# Altium project 新zynq底板.PrjPcb (part 1 of 2)
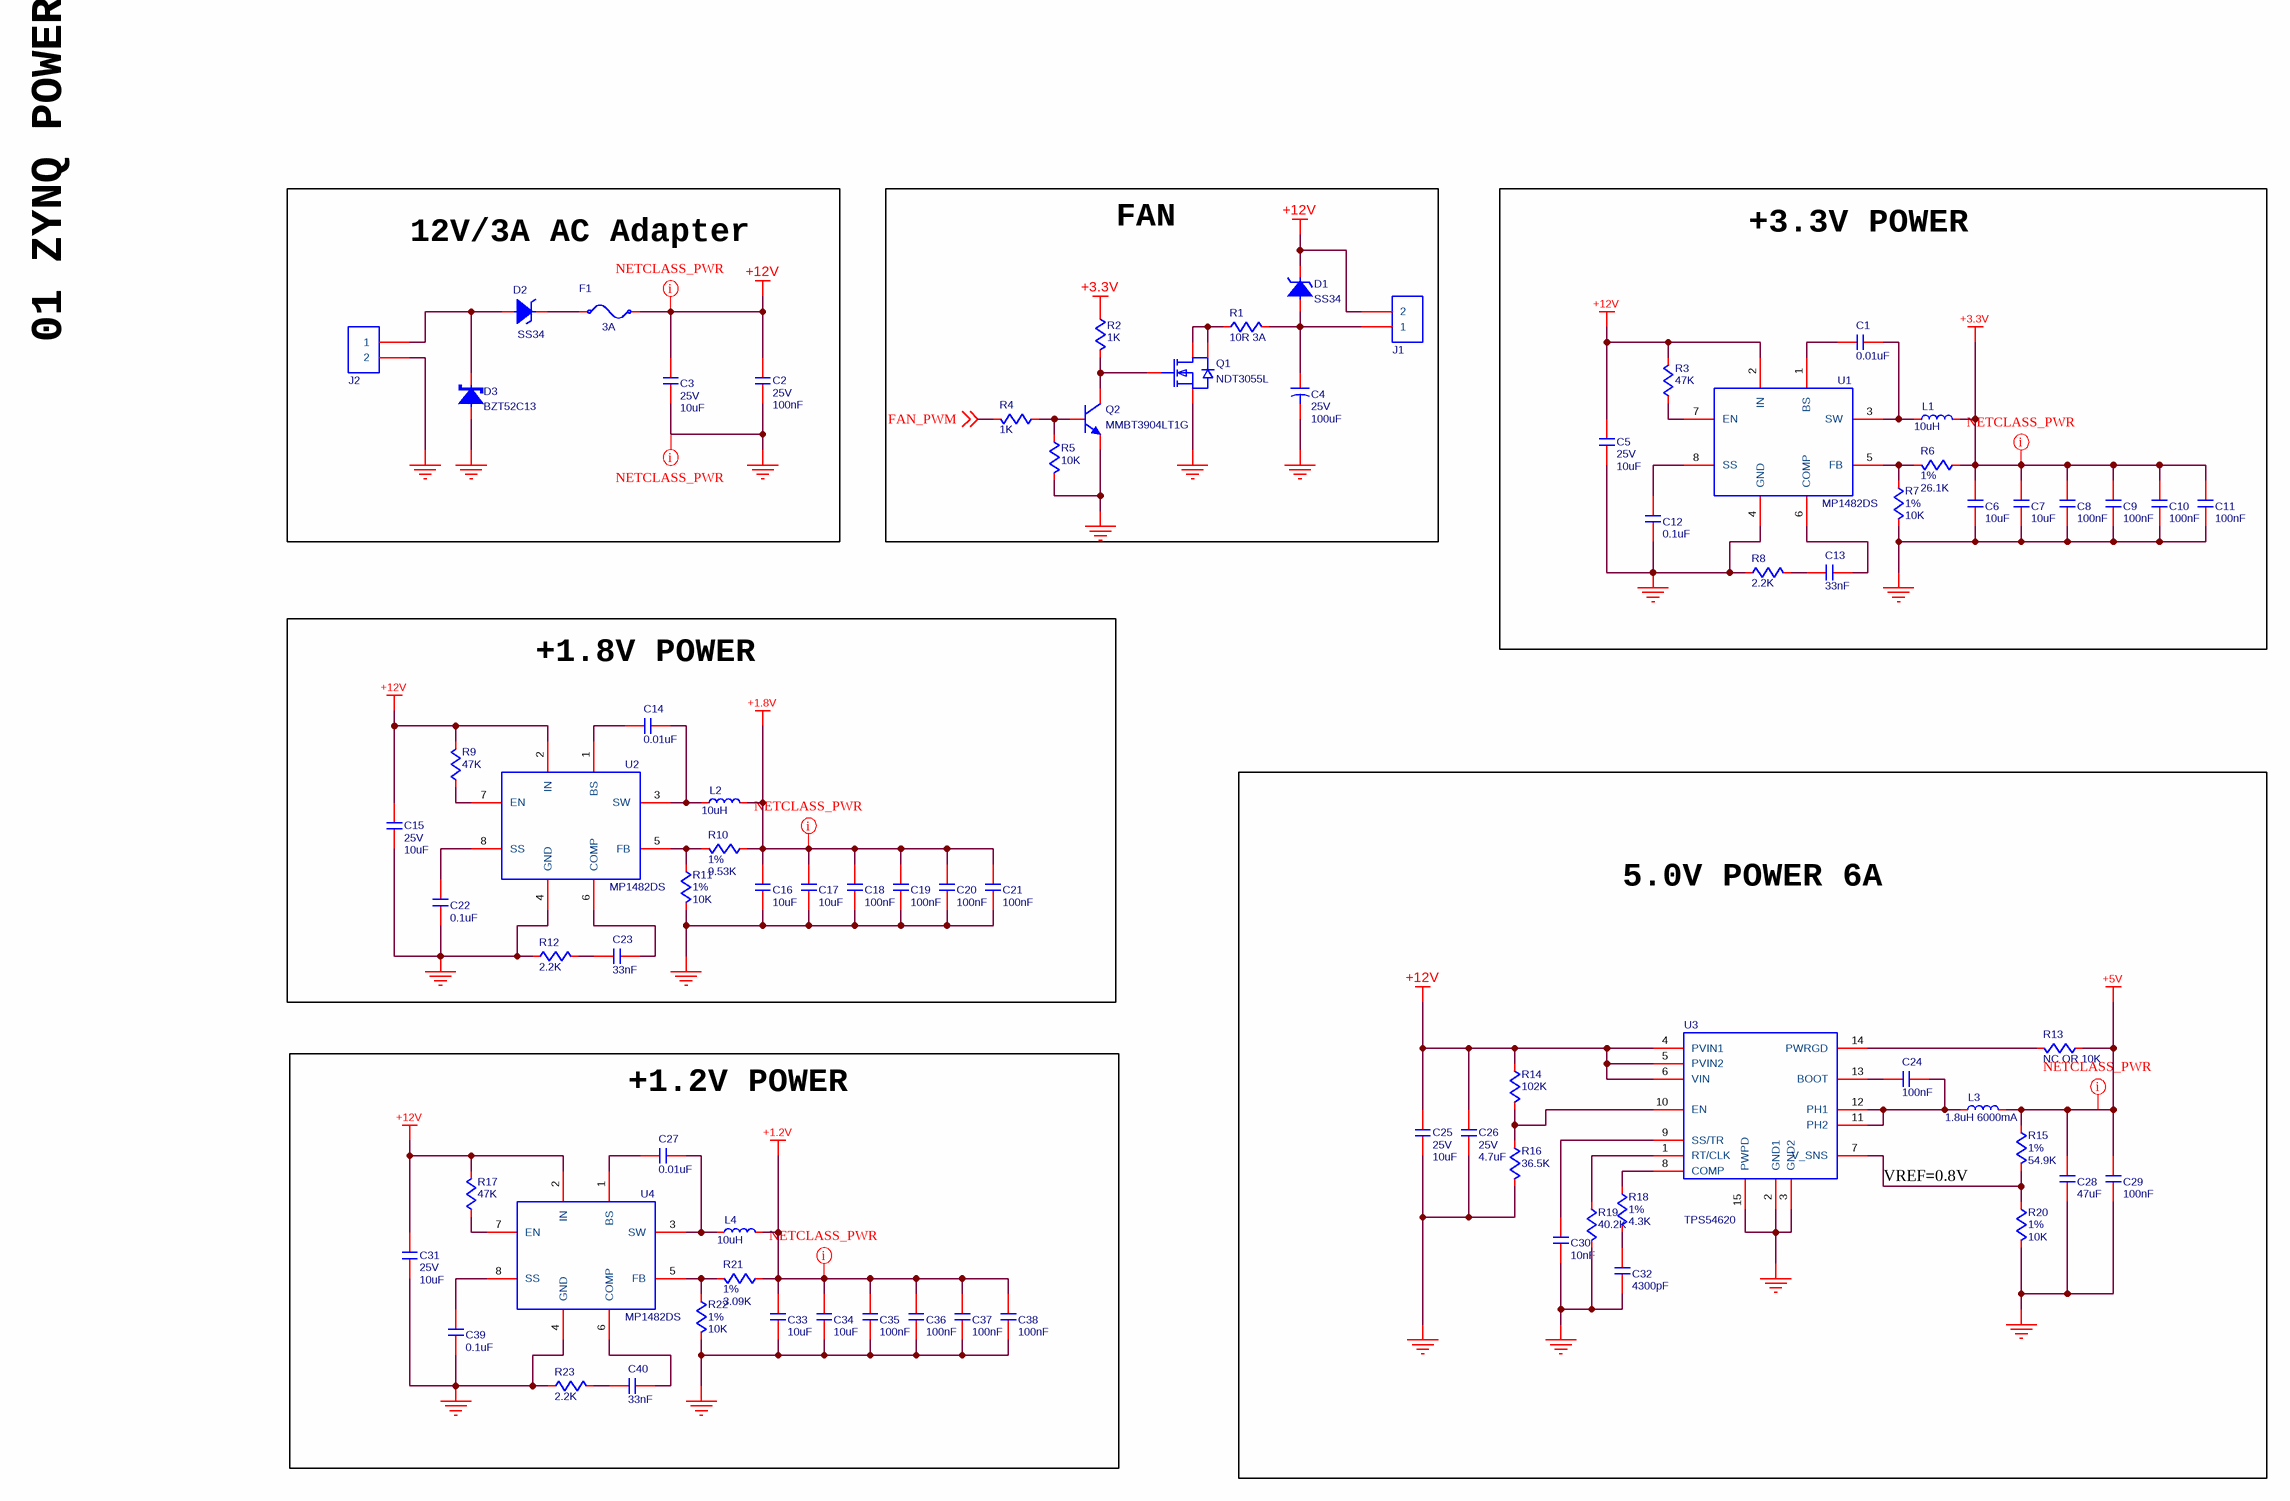
[diagram p0: 01_ZYNQ_POWER.SchDoc]
7 sheets, 397 parts. Net scope: global (net labels, ports and power ports of the same name join across sheets).
Board file: dingkun.PcbDoc
Sheets:
  01_ZYNQ_POWER.SchDoc
  02_ZYNQ_CORE_POS.SchDoc
  03_ZYNQ_JTAG_BOOT.SchDoc
  04_ZYNQ_MISC_INTERFACE.SchDoc
  05_ZYNQ_ETHERNET.SchDoc
  06_ZYNQ_CAMERALINK.SchDoc
  07_ZYNQ_CAMERALINK.SchDoc

## Sheet 01_ZYNQ_POWER.SchDoc
size 420 x 297 mm; SheetNumber: 1; SheetTotal: 7

### Parts
C1  value 0.01uF  [C0402]  (hidden comment: C-NOMO)
C2  value 100nF  voltage: 25V  [C0402]  (hidden comment: C-NOMO)
C3  value 10uF  voltage: 25V  [C0805]  (hidden comment: C-NOMO)
C4  value 100uF  voltage: 25V  [C7343]  (hidden comment: C-POL)
C5  value 10uF  voltage: 25V  [C0805]  (hidden comment: C-NOMO)
C6  value 10uF  [C0805]  (hidden comment: C-NOMO)
C7  value 10uF  [C0805]  (hidden comment: C-NOMO)
C8  value 100nF  [C0402]  (hidden comment: C-NOMO)
C9  value 100nF  [C0402]  (hidden comment: C-NOMO)
C10  value 100nF  [C0402]  (hidden comment: C-NOMO)
C11  value 100nF  [C0402]  (hidden comment: C-NOMO)
C12  value 0.1uF  [C0402]  (hidden comment: C-NOMO)
C13  value 33nF  [C0402]  (hidden comment: C-NOMO)
C14  value 0.01uF  [C0402]  (hidden comment: C-NOMO)
C15  value 10uF  voltage: 25V  [C0805]  (hidden comment: C-NOMO)
C16  value 10uF  [C0805]  (hidden comment: C-NOMO)
C17  value 10uF  [C0805]  (hidden comment: C-NOMO)
C18  value 100nF  [C0402]  (hidden comment: C-NOMO)
C19  value 100nF  [C0402]  (hidden comment: C-NOMO)
C20  value 100nF  [C0402]  (hidden comment: C-NOMO)
C21  value 100nF  [C0402]  (hidden comment: C-NOMO)
C22  value 0.1uF  [C0402]  (hidden comment: C-NOMO)
C23  value 33nF  [C0402]  (hidden comment: C-NOMO)
C24  value 100nF  [C0402]  (hidden comment: C-NOMO)
C25  value 10uF  voltage: 25V  [C0805]  (hidden comment: C-NOMO)
C26  value 4.7uF  voltage: 25V  [C0805]  (hidden comment: C-NOMO)
C27  value 0.01uF  [C0402]  (hidden comment: C-NOMO)
C28  value 47uF  [C0805]  (hidden comment: C-NOMO)
C29  value 100nF  [C0402]  (hidden comment: C-NOMO)
C30  value 10nF  [C0402]  (hidden comment: C-NOMO)
C31  value 10uF  voltage: 25V  [C0805]  (hidden comment: C-NOMO)
C32  value 4300pF  [C0402]  (hidden comment: C-NOMO)
C33  value 10uF  [C0805]  (hidden comment: C-NOMO)
C34  value 10uF  [C0805]  (hidden comment: C-NOMO)
C35  value 100nF  [C0402]  (hidden comment: C-NOMO)
C36  value 100nF  [C0402]  (hidden comment: C-NOMO)
C37  value 100nF  [C0402]  (hidden comment: C-NOMO)
C38  value 100nF  [C0402]  (hidden comment: C-NOMO)
C39  value 0.1uF  [C0402]  (hidden comment: C-NOMO)
C40  value 33nF  [C0402]  (hidden comment: C-NOMO)
D1  SS34  [DO-214AC]
D2  SS34  [DO-214AC]
D3  BZT52C13  [DO-214AC]
F1  3A  [F1812]
J1  HDR1X2  [XH-2A]  (value not drawn)
J2  HDR1X2  [KF301-5.0-2P]  (value not drawn)
L1  value 10uH  [FXL0624]  (hidden comment: L)
L2  value 10uH  [FXL0624]  (hidden comment: L)
L3  value 1.8uH 6000mA  [FXL0624]  (hidden comment: L)
L4  value 10uH  [FXL0624]  (hidden comment: L)
Q1  NDT3055L  [SOT-223]
Q2  MMBT3904LT1G  [SOT-23]
R1  value 10R 3A  [R1812]  (hidden comment: R)
R2  value 1K  [R0402]  (hidden comment: R)
R3  value 47K  [R0402]  (hidden comment: R)
R4  value 1K  [R0402]  (hidden comment: R)
R5  value 10K  [R0402]  (hidden comment: R)
R6  value 26.1K  precision: 1%  [R0402]  (hidden comment: R)
R7  value 10K  precision: 1%  [R0402]  (hidden comment: R)
R8  value 2.2K  [R0402]  (hidden comment: R)
R9  value 47K  [R0402]  (hidden comment: R)
R10  value 9.53K  precision: 1%  [R0402]  (hidden comment: R)
R11  value 10K  precision: 1%  [R0402]  (hidden comment: R)
R12  value 2.2K  [R0402]  (hidden comment: R)
R13  value NC OR 10K  [R0402]  (hidden comment: R)
R14  value 102K  [R0402]  (hidden comment: R)
R15  value 54.9K  precision: 1%  [R0603]  (hidden comment: R)
R16  value 36.5K  [R0402]  (hidden comment: R)
R17  value 47K  [R0402]  (hidden comment: R)
R18  value 4.3K  precision: 1%  [R0402]  (hidden comment: R)
R19  value 40.2K  [R0402]  (hidden comment: R)
R20  value 10K  precision: 1%  [R0603]  (hidden comment: R)
R21  value 3.09K  precision: 1%  [R0402]  (hidden comment: R)
R22  value 10K  precision: 1%  [R0402]  (hidden comment: R)
R23  value 2.2K  [R0402]  (hidden comment: R)
U1  MP1482DS  [MP1482]
U2  MP1482DS  [MP1482]
U3  TPS54620  [TPS54620]
U4  MP1482DS  [MP1482]

### Blocks framed on the sheet
12V/3A AC Adapter: C2 C3 D2 D3 F1 J2
FAN: C4 D1 J1 Q1 Q2 R1 R2 R4 R5
+3.3V POWER: C1 C5-C13 L1 R3 R6-R8 U1
+1.8V POWER: C14-C23 L2 R9-R12 U2
5.0V POWER 6A: C24-C26 C28-C30 C32 L3 R13-R16 R18-R20 U3
+1.2V POWER: C27 C31 C33-C40 L4 R17 R21-R23 U4

### Nets
+1.2V: C33.2 C34.2 C35.2 C36.2 C37.2 C38.2 L4.2 R21.2
+1.8V: C16.2 C17.2 C18.2 C19.2 C20.2 C21.2 L2.2 R10.2
+3.3V: C6.2 C7.2 C8.2 C9.2 C10.2 C11.2 L1.2 R2.2 R6.2
+5V: C28.1 C29.1 L3.2 R13.2 R15.2
+12V: C2.2 C3.2 C5.2 C15.2 C25.2 C26.2 C31.2 D1.1 F1.2 J1.2 R3.1 R9.1 R14.2 R17.1 U1.2(IN) U2.2(IN) U3.4(PVIN1) U3.5(PVIN2) U3.6(VIN) U4.2(IN)
GND: C2.1 C3.1 C4.2 C5.1 C6.1 C7.1 C8.1 C9.1 C10.1 C11.1 C12.1 C15.1 C16.1 C17.1 C18.1 C19.1 C20.1 C21.1 C22.1 C25.1 C26.1 C28.2 C29.2 C30.1 C31.1 C32.1 C33.1 C34.1 C35.1 C36.1 C37.1 C38.1 C39.1 D3.2 J2.2 Q1.3(S) Q2.2(E) R5.1 R7.1 R8.2 R11.1 R12.2 R16.1 R19.1 R20.1 R22.1 R23.2 U1.4(GND) U2.4(GND) U3.2(GND1) U3.3(GND2) U3.15(PWPD) U4.4(GND)
FAN_PWM: R4.1 ; off-sheet FAN_PWM
NetC1_1: C1.1 L1.1 U1.3(SW)
NetC1_2: C1.2 U1.1(BS)
NetC4_1: C4.1 D1.2 J1.1 R1.1
NetC12_2: C12.2 U1.8(SS)
NetC13_1: C13.1 U1.6(COMP)
NetC13_2: C13.2 R8.1
NetC14_1: C14.1 L2.1 U2.3(SW)
NetC14_2: C14.2 U2.1(BS)
NetC22_2: C22.2 U2.8(SS)
NetC23_1: C23.1 U2.6(COMP)
NetC23_2: C23.2 R12.1
NetC24_1: C24.1 L3.1 U3.11(PH2) U3.12(PH1)
NetC24_2: C24.2 U3.13(BOOT)
NetC27_1: C27.1 L4.1 U4.3(SW)
NetC27_2: C27.2 U4.1(BS)
NetC30_2: C30.2 U3.9(SS/TR)
NetC32_2: C32.2 R18.1
NetC39_2: C39.2 U4.8(SS)
NetC40_1: C40.1 U4.6(COMP)
NetC40_2: C40.2 R23.1
NetD2_1: D2.1 F1.1
NetD2_2: D2.2 D3.1 J2.1
NetQ1_1: Q1.1(G) Q2.3(C) R2.1
NetQ1_2: Q1.2(D) Q1.4(D) R1.2
NetQ2_1: Q2.1(B) R4.2 R5.2
NetR3_2: R3.2 U1.7(EN)
NetR6_1: R6.1 R7.2 U1.5(FB)
NetR9_2: R9.2 U2.7(EN)
NetR10_1: R10.1 R11.2 U2.5(FB)
NetR13_1: R13.1 U3.14(PWRGD)
NetR14_1: R14.1 R16.2 U3.10(EN)
NetR15_1: R15.1 R20.2 U3.7(V_SNS)
NetR17_2: R17.2 U4.7(EN)
NetR18_2: R18.2 U3.8(COMP)
NetR19_2: R19.2 U3.1(RT/CLK)
NetR21_1: R21.1 R22.2 U4.5(FB)

### Layout directives
net class NETCLASS_PWR: +1.2V, +1.8V, +3.3V, +5V, +12V, GND

### Notes on the sheet
- 01 ZYNQ POWER
- VREF=0.8V
- THIS DOCUMENT AND THE DATA DISCLOSED HEREIN OR
- HEREWITH IS THE PROPERTY OF ALTIUM LIMITED AND MAY
- DWG NO:
- REVISION
- REV:
- DESCRIPTION
- DATE
- APPROVED
- BE FREELY DISTRIBUTED IN WHOLE. NO RIGHTS ARE
- RESERVED OR EXPRESS OR IMPLIED WARANTEE GIVEN.
- ENG:
- APPROVALS
- PROJECT
- DSN:
- CHK:
- REFERENCE DOCUMENTS
- PROJECT REVISION:
- TITLE
- DOCUMENT REVISION:
- DESIGN ITEM:
- BOM:
- FAB DWG:
- PCB DWG:
- ASSY DWG:
- SCALE:
- A3
- SIZE
- CAGE CODE
- FILE NAME
- DWG NO.
- SHEET
- OF
- REV

### Library data of the parts
C1 C6-C14 C16-C24 C27-C30 C32-C40 = C-NOMO: voltage: 25V; precision: 5%
C2 C3 C5 C15 C25 C26 C31 = C-NOMO: precision: 5%
D1 D2 = DIOD2: BAS16XV2T1G
D3 = DIOD3
F1 = FUSE
L1-L4 = L: Code_IEC: 1005; Published: 8-Jun-2000; LatestRevisionDate: 29-May-2009; LatestRevisionNote: IPC-7351 Footprint Added.; PackageReference: 0402-A; Publisher: Altium Limited; PackageDescription: Chip Inductor; Code_JEITA: 0402
Q2 = NPN
R1-R5 R8 R9 R12-R14 R16 R17 R19 R23 = R: precision: 1%

## Sheet 02_ZYNQ_CORE_POS.SchDoc
size 566 x 398 mm; SheetNumber: 2; SheetTotal: 7
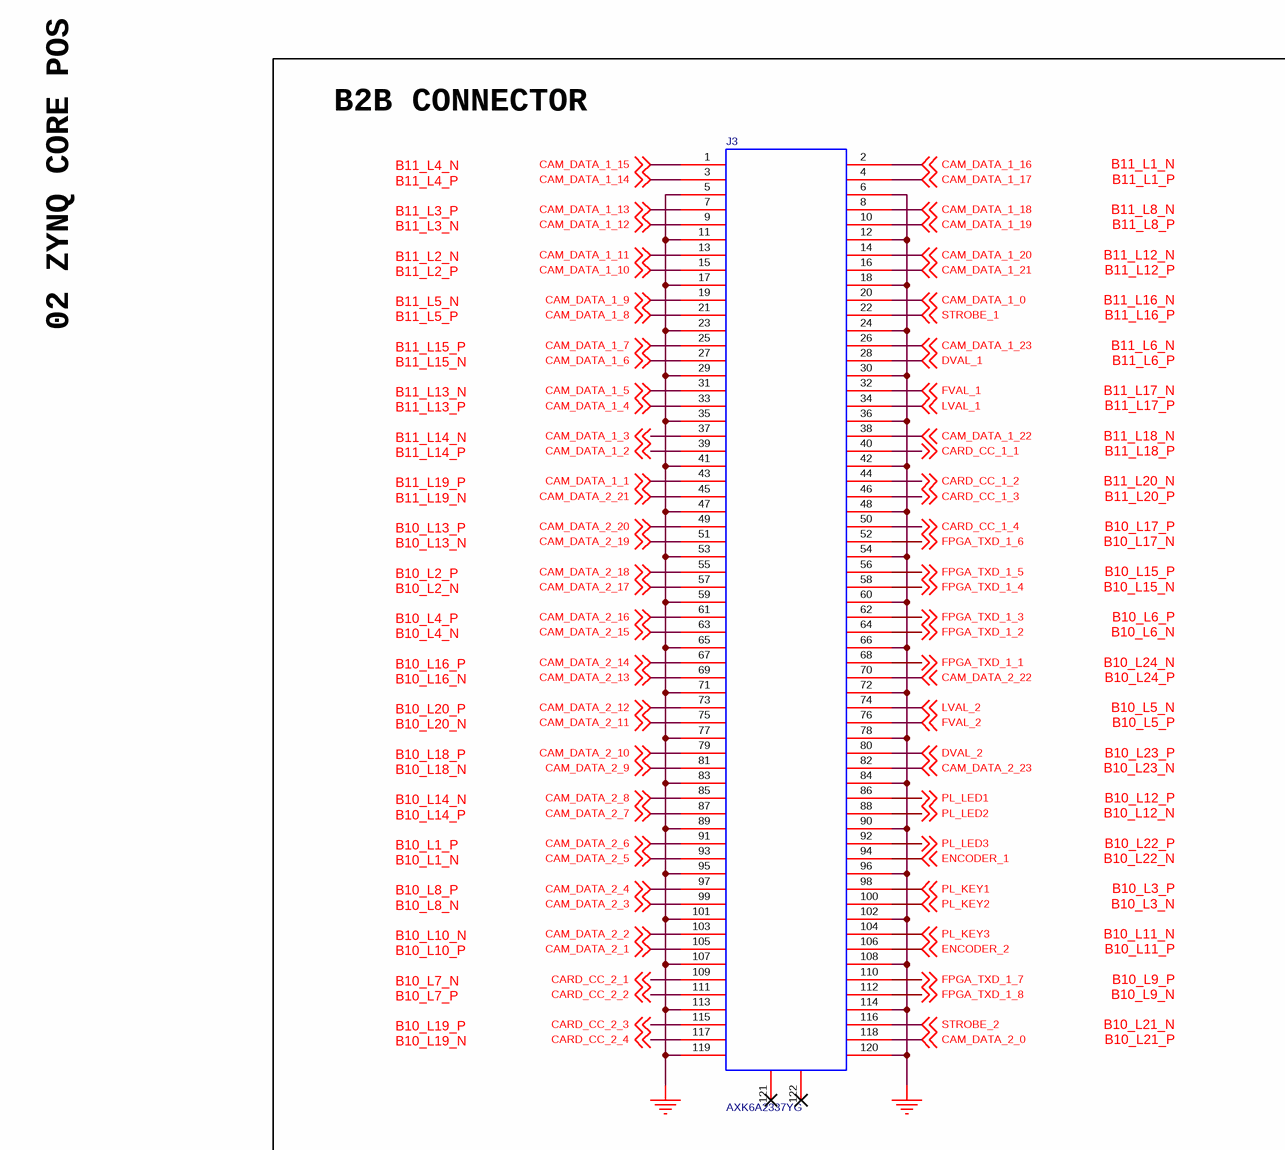
[diagram p1: 02_ZYNQ_CORE_POS.SchDoc, top left]
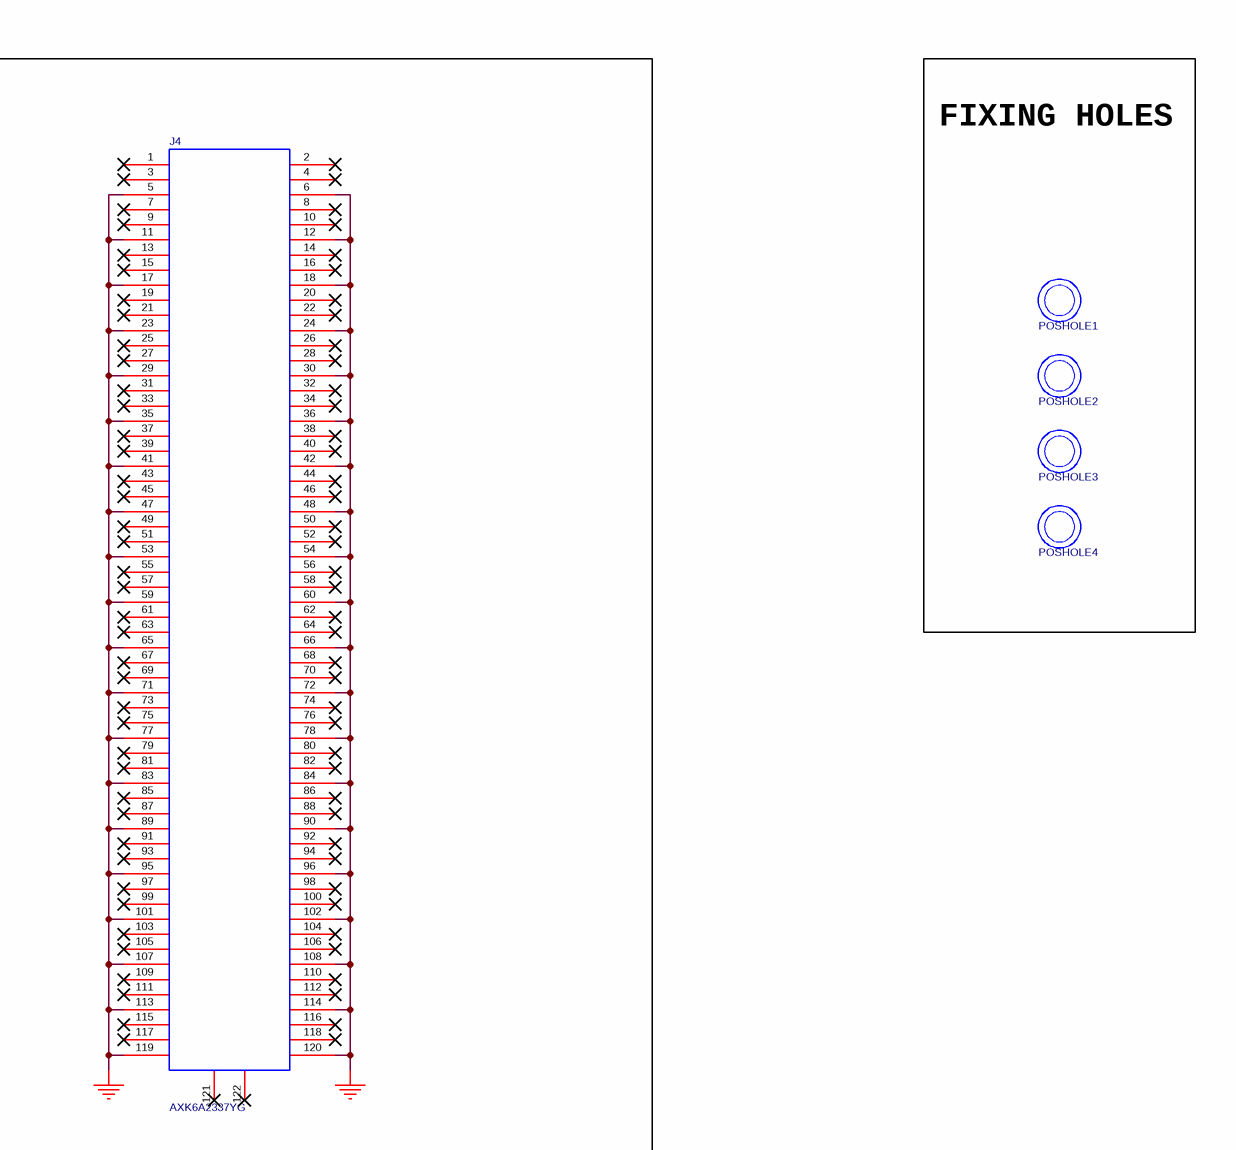
[diagram p2: 02_ZYNQ_CORE_POS.SchDoc, top right]
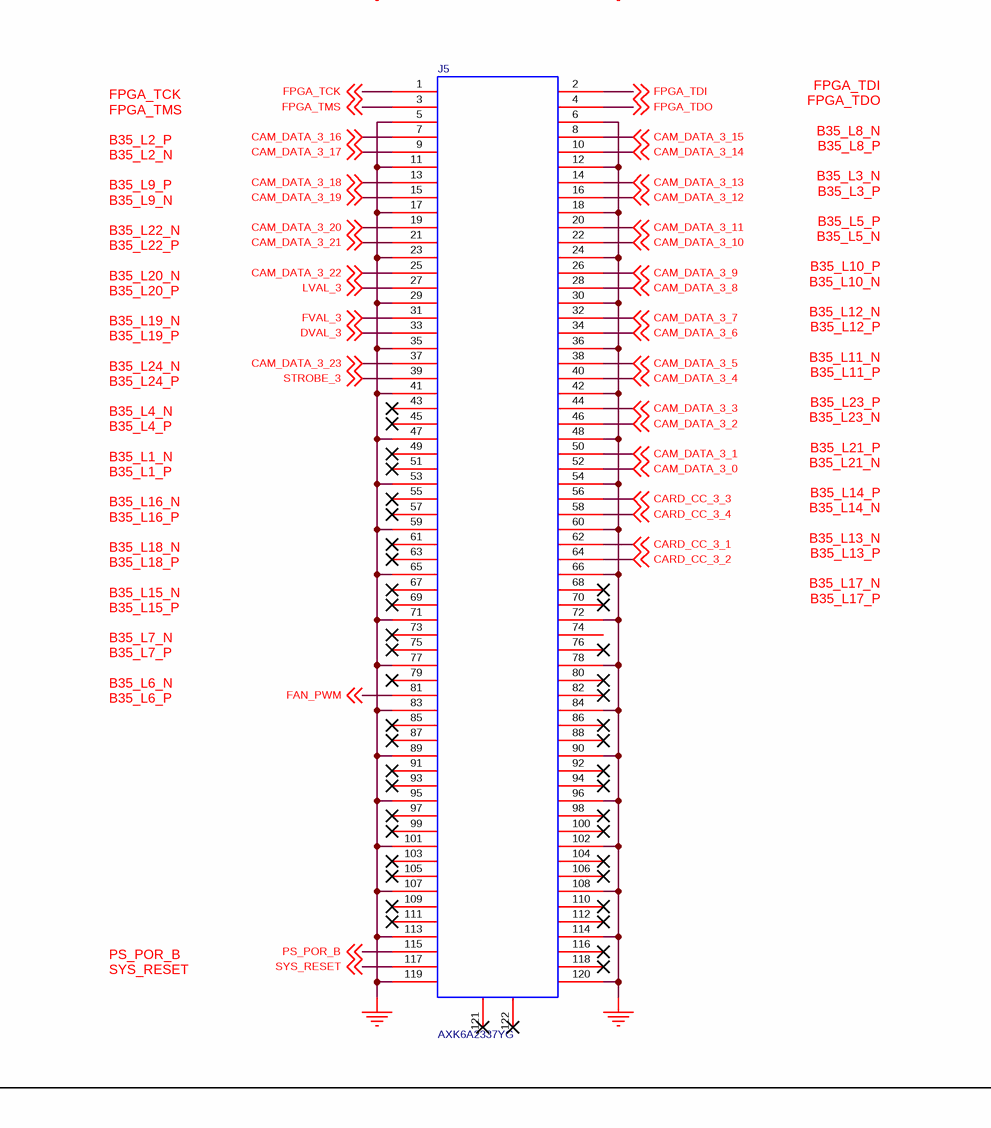
[diagram p3: 02_ZYNQ_CORE_POS.SchDoc, bottom left]
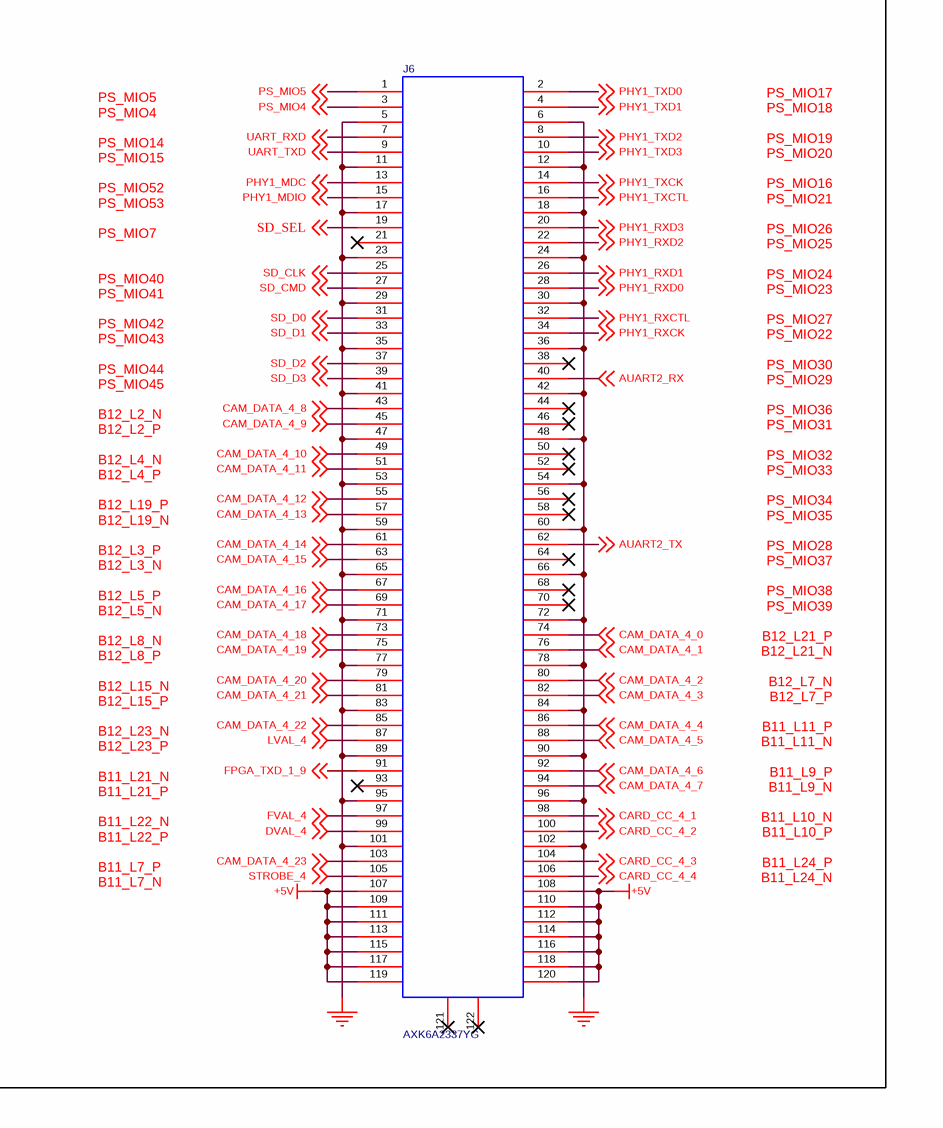
[diagram p4: 02_ZYNQ_CORE_POS.SchDoc, bottom right]

### Parts
J3  AXK6A2337YG  [AXK620337YG]
J4  AXK6A2337YG  [AXK620337YG]
J5  AXK6A2337YG  [AXK620337YG]
J6  AXK6A2337YG  [AXK620337YG]
POSHOLE1  POSHOLE  [POSHOLE-3.2]  (value not drawn)
POSHOLE2  POSHOLE  [POSHOLE-3.2]  (value not drawn)
POSHOLE3  POSHOLE  [POSHOLE-3.2]  (value not drawn)
POSHOLE4  POSHOLE  [POSHOLE-3.2]  (value not drawn)

### Blocks framed on the sheet
B2B CONNECTOR: J3-J6
FIXING HOLES: POSHOLE1-POSHOLE4

### Nets
+5V: J6.107 J6.108 J6.109 J6.110 J6.111 J6.112 J6.113 J6.114 J6.115 J6.116 J6.117 J6.118 J6.119 J6.120
GND: J3.5 J3.6 J3.11 J3.12 J3.17 J3.18 J3.23 J3.24 J3.29 J3.30 J3.35 J3.36 J3.41 J3.42 J3.47 J3.48 J3.53 J3.54 J3.59 J3.60 J3.65 J3.66 J3.71 J3.72 J3.77 J3.78 J3.83 J3.84 J3.89 J3.90 J3.95 J3.96 J3.101 J3.102 J3.107 J3.108 J3.113 J3.114 J3.119 J3.120 J4.5 J4.6 J4.11 J4.12 J4.17 J4.18 J4.23 J4.24 J4.29 J4.30 J4.35 J4.36 J4.41 J4.42 J4.47 J4.48 J4.53 J4.54 J4.59 J4.60 J4.65 J4.66 J4.71 J4.72 J4.77 J4.78 J4.83 J4.84 J4.89 J4.90 J4.95 J4.96 J4.101 J4.102 J4.107 J4.108 J4.113 J4.114 J4.119 J4.120 J5.5 J5.6 J5.11 J5.12 J5.17 J5.18 J5.23 J5.24 J5.29 J5.30 J5.35 J5.36 J5.41 J5.42 J5.47 J5.48 J5.53 J5.54 J5.59 J5.60 J5.65 J5.66 J5.71 J5.72 J5.77 J5.78 J5.83 J5.84 J5.89 J5.90 J5.95 J5.96 J5.101 J5.102 J5.107 J5.108 J5.113 J5.114 J5.119 J5.120 J6.5 J6.6 J6.11 J6.12 J6.17 J6.18 J6.23 J6.24 J6.29 J6.30 J6.35 J6.36 J6.41 J6.42 J6.47 J6.48 J6.53 J6.54 J6.59 J6.60 J6.65 J6.66 J6.71 J6.72 J6.77 J6.78 J6.83 J6.84 J6.89 J6.90 J6.95 J6.96 J6.101 J6.102
AUART2_RX: J6.40 ; off-sheet AUART2_RX
AUART2_TX: J6.62 ; off-sheet AUART2_TX
CAM_DATA_1_0: J3.20 ; off-sheet CAM_DATA_1_0
CAM_DATA_1_1: J3.43 ; off-sheet CAM_DATA_1_1
CAM_DATA_1_2: J3.39 ; off-sheet CAM_DATA_1_2
CAM_DATA_1_3: J3.37 ; off-sheet CAM_DATA_1_3
CAM_DATA_1_4: J3.33 ; off-sheet CAM_DATA_1_4
CAM_DATA_1_5: J3.31 ; off-sheet CAM_DATA_1_5
CAM_DATA_1_6: J3.27 ; off-sheet CAM_DATA_1_6
CAM_DATA_1_7: J3.25 ; off-sheet CAM_DATA_1_7
CAM_DATA_1_8: J3.21 ; off-sheet CAM_DATA_1_8
CAM_DATA_1_9: J3.19 ; off-sheet CAM_DATA_1_9
CAM_DATA_1_10: J3.15 ; off-sheet CAM_DATA_1_10
CAM_DATA_1_11: J3.13 ; off-sheet CAM_DATA_1_11
CAM_DATA_1_12: J3.9 ; off-sheet CAM_DATA_1_12
CAM_DATA_1_13: J3.7 ; off-sheet CAM_DATA_1_13
CAM_DATA_1_14: J3.3 ; off-sheet CAM_DATA_1_14
CAM_DATA_1_15: J3.1 ; off-sheet CAM_DATA_1_15
CAM_DATA_1_16: J3.2 ; off-sheet CAM_DATA_1_16
CAM_DATA_1_17: J3.4 ; off-sheet CAM_DATA_1_17
CAM_DATA_1_18: J3.8 ; off-sheet CAM_DATA_1_18
CAM_DATA_1_19: J3.10 ; off-sheet CAM_DATA_1_19
CAM_DATA_1_20: J3.14 ; off-sheet CAM_DATA_1_20
CAM_DATA_1_21: J3.16 ; off-sheet CAM_DATA_1_21
CAM_DATA_1_22: J3.38 ; off-sheet CAM_DATA_1_22
CAM_DATA_1_23: J3.26 ; off-sheet CAM_DATA_1_23
CAM_DATA_2_0: J3.118 ; off-sheet CAM_DATA_2_0
CAM_DATA_2_1: J3.105 ; off-sheet CAM_DATA_2_1
CAM_DATA_2_2: J3.103 ; off-sheet CAM_DATA_2_2
CAM_DATA_2_3: J3.99 ; off-sheet CAM_DATA_2_3
CAM_DATA_2_4: J3.97 ; off-sheet CAM_DATA_2_4
CAM_DATA_2_5: J3.93 ; off-sheet CAM_DATA_2_5
CAM_DATA_2_6: J3.91 ; off-sheet CAM_DATA_2_6
CAM_DATA_2_7: J3.87 ; off-sheet CAM_DATA_2_7
CAM_DATA_2_8: J3.85 ; off-sheet CAM_DATA_2_8
CAM_DATA_2_9: J3.81 ; off-sheet CAM_DATA_2_9
CAM_DATA_2_10: J3.79 ; off-sheet CAM_DATA_2_10
CAM_DATA_2_11: J3.75 ; off-sheet CAM_DATA_2_11
CAM_DATA_2_12: J3.73 ; off-sheet CAM_DATA_2_12
CAM_DATA_2_13: J3.69 ; off-sheet CAM_DATA_2_13
CAM_DATA_2_14: J3.67 ; off-sheet CAM_DATA_2_14
CAM_DATA_2_15: J3.63 ; off-sheet CAM_DATA_2_15
CAM_DATA_2_16: J3.61 ; off-sheet CAM_DATA_2_16
CAM_DATA_2_17: J3.57 ; off-sheet CAM_DATA_2_17
CAM_DATA_2_18: J3.55 ; off-sheet CAM_DATA_2_18
CAM_DATA_2_19: J3.51 ; off-sheet CAM_DATA_2_19
CAM_DATA_2_20: J3.49 ; off-sheet CAM_DATA_2_20
CAM_DATA_2_21: J3.45 ; off-sheet CAM_DATA_2_21
CAM_DATA_2_22: J3.70 ; off-sheet CAM_DATA_2_22
CAM_DATA_2_23: J3.82 ; off-sheet CAM_DATA_2_23
CAM_DATA_3_0: J5.52 ; off-sheet CAM_DATA_3_0
CAM_DATA_3_1: J5.50 ; off-sheet CAM_DATA_3_1
CAM_DATA_3_2: J5.46 ; off-sheet CAM_DATA_3_2
CAM_DATA_3_3: J5.44 ; off-sheet CAM_DATA_3_3
CAM_DATA_3_4: J5.40 ; off-sheet CAM_DATA_3_4
CAM_DATA_3_5: J5.38 ; off-sheet CAM_DATA_3_5
CAM_DATA_3_6: J5.34 ; off-sheet CAM_DATA_3_6
CAM_DATA_3_7: J5.32 ; off-sheet CAM_DATA_3_7
CAM_DATA_3_8: J5.28 ; off-sheet CAM_DATA_3_8
CAM_DATA_3_9: J5.26 ; off-sheet CAM_DATA_3_9
CAM_DATA_3_10: J5.22 ; off-sheet CAM_DATA_3_10
CAM_DATA_3_11: J5.20 ; off-sheet CAM_DATA_3_11
CAM_DATA_3_12: J5.16 ; off-sheet CAM_DATA_3_12
CAM_DATA_3_13: J5.14 ; off-sheet CAM_DATA_3_13
CAM_DATA_3_14: J5.10 ; off-sheet CAM_DATA_3_14
CAM_DATA_3_15: J5.8 ; off-sheet CAM_DATA_3_15
CAM_DATA_3_16: J5.7 ; off-sheet CAM_DATA_3_16
CAM_DATA_3_17: J5.9 ; off-sheet CAM_DATA_3_17
CAM_DATA_3_18: J5.13 ; off-sheet CAM_DATA_3_18
CAM_DATA_3_19: J5.15 ; off-sheet CAM_DATA_3_19
CAM_DATA_3_20: J5.19 ; off-sheet CAM_DATA_3_20
CAM_DATA_3_21: J5.21 ; off-sheet CAM_DATA_3_21
CAM_DATA_3_22: J5.25 ; off-sheet CAM_DATA_3_22
CAM_DATA_3_23: J5.37 ; off-sheet CAM_DATA_3_23
CAM_DATA_4_0: J6.74 ; off-sheet CAM_DATA_4_0
CAM_DATA_4_1: J6.76 ; off-sheet CAM_DATA_4_1
CAM_DATA_4_2: J6.80 ; off-sheet CAM_DATA_4_2
CAM_DATA_4_3: J6.82 ; off-sheet CAM_DATA_4_3
CAM_DATA_4_4: J6.86 ; off-sheet CAM_DATA_4_4
CAM_DATA_4_5: J6.88 ; off-sheet CAM_DATA_4_5
CAM_DATA_4_6: J6.92 ; off-sheet CAM_DATA_4_6
CAM_DATA_4_7: J6.94 ; off-sheet CAM_DATA_4_7
CAM_DATA_4_8: J6.43 ; off-sheet CAM_DATA_4_8
CAM_DATA_4_9: J6.45 ; off-sheet CAM_DATA_4_9
CAM_DATA_4_10: J6.49 ; off-sheet CAM_DATA_4_10
CAM_DATA_4_11: J6.51 ; off-sheet CAM_DATA_4_11
CAM_DATA_4_12: J6.55 ; off-sheet CAM_DATA_4_12
CAM_DATA_4_13: J6.57 ; off-sheet CAM_DATA_4_13
CAM_DATA_4_14: J6.61 ; off-sheet CAM_DATA_4_14
CAM_DATA_4_15: J6.63 ; off-sheet CAM_DATA_4_15
CAM_DATA_4_16: J6.67 ; off-sheet CAM_DATA_4_16
CAM_DATA_4_17: J6.69 ; off-sheet CAM_DATA_4_17
CAM_DATA_4_18: J6.73 ; off-sheet CAM_DATA_4_18
CAM_DATA_4_19: J6.75 ; off-sheet CAM_DATA_4_19
CAM_DATA_4_20: J6.79 ; off-sheet CAM_DATA_4_20
CAM_DATA_4_21: J6.81 ; off-sheet CAM_DATA_4_21
CAM_DATA_4_22: J6.85 ; off-sheet CAM_DATA_4_22
CAM_DATA_4_23: J6.103 ; off-sheet CAM_DATA_4_23
CARD_CC_1_1: J3.40 ; off-sheet CARD_CC_1_1
CARD_CC_1_2: J3.44 ; off-sheet CARD_CC_1_2
CARD_CC_1_3: J3.46 ; off-sheet CARD_CC_1_3
CARD_CC_1_4: J3.50 ; off-sheet CARD_CC_1_4
CARD_CC_2_1: J3.109 ; off-sheet CARD_CC_2_1
CARD_CC_2_2: J3.111 ; off-sheet CARD_CC_2_2
CARD_CC_2_3: J3.115 ; off-sheet CARD_CC_2_3
CARD_CC_2_4: J3.117 ; off-sheet CARD_CC_2_4
CARD_CC_3_1: J5.62 ; off-sheet CARD_CC_3_1
CARD_CC_3_2: J5.64 ; off-sheet CARD_CC_3_2
CARD_CC_3_3: J5.56 ; off-sheet CARD_CC_3_3
CARD_CC_3_4: J5.58 ; off-sheet CARD_CC_3_4
CARD_CC_4_1: J6.98 ; off-sheet CARD_CC_4_1
CARD_CC_4_2: J6.100 ; off-sheet CARD_CC_4_2
CARD_CC_4_3: J6.104 ; off-sheet CARD_CC_4_3
CARD_CC_4_4: J6.106 ; off-sheet CARD_CC_4_4
DVAL_1: J3.28 ; off-sheet DVAL_1
DVAL_2: J3.80 ; off-sheet DVAL_2
DVAL_3: J5.33 ; off-sheet DVAL_3
DVAL_4: J6.99 ; off-sheet DVAL_4
ENCODER_1: J3.94 ; off-sheet ENCODER_1
ENCODER_2: J3.106 ; off-sheet ENCODER_2
FAN_PWM: J5.81 ; off-sheet FAN_PWM
FPGA_TCK: J5.1 ; off-sheet FPGA_TCK
FPGA_TDI: J5.2 ; off-sheet FPGA_TDI
FPGA_TDO: J5.4 ; off-sheet FPGA_TDO
FPGA_TMS: J5.3 ; off-sheet FPGA_TMS
FPGA_TXD_1_1: J3.68 ; off-sheet FPGA_TXD_1_1
FPGA_TXD_1_2: J3.64 ; off-sheet FPGA_TXD_1_2
FPGA_TXD_1_3: J3.62 ; off-sheet FPGA_TXD_1_3
FPGA_TXD_1_4: J3.58 ; off-sheet FPGA_TXD_1_4
FPGA_TXD_1_5: J3.56 ; off-sheet FPGA_TXD_1_5
FPGA_TXD_1_6: J3.52 ; off-sheet FPGA_TXD_1_6
FPGA_TXD_1_7: J3.110 ; off-sheet FPGA_TXD_1_7
FPGA_TXD_1_8: J3.112 ; off-sheet FPGA_TXD_1_8
FPGA_TXD_1_9: J6.91 ; off-sheet FPGA_TXD_1_9
FVAL_1: J3.32 ; off-sheet FVAL_1
FVAL_2: J3.76 ; off-sheet FVAL_2
FVAL_3: J5.31 ; off-sheet FVAL_3
FVAL_4: J6.97 ; off-sheet FVAL_4
LVAL_1: J3.34 ; off-sheet LVAL_1
LVAL_2: J3.74 ; off-sheet LVAL_2
LVAL_3: J5.27 ; off-sheet LVAL_3
LVAL_4: J6.87 ; off-sheet LVAL_4
PHY1_MDC: J6.13 ; off-sheet PHY1_MDC
PHY1_MDIO: J6.15 ; off-sheet PHY1_MDIO
PHY1_RXCK: J6.34 ; off-sheet PHY1_RXCK
PHY1_RXCTL: J6.32 ; off-sheet PHY1_RXCTL
PHY1_RXD0: J6.28 ; off-sheet PHY1_RXD0
PHY1_RXD1: J6.26 ; off-sheet PHY1_RXD1
PHY1_RXD2: J6.22 ; off-sheet PHY1_RXD2
PHY1_RXD3: J6.20 ; off-sheet PHY1_RXD3
PHY1_TXCK: J6.14 ; off-sheet PHY1_TXCK
PHY1_TXCTL: J6.16 ; off-sheet PHY1_TXCTL
PHY1_TXD0: J6.2 ; off-sheet PHY1_TXD0
PHY1_TXD1: J6.4 ; off-sheet PHY1_TXD1
PHY1_TXD2: J6.8 ; off-sheet PHY1_TXD2
PHY1_TXD3: J6.10 ; off-sheet PHY1_TXD3
PL_KEY1: J3.98 ; off-sheet PL_KEY1
PL_KEY2: J3.100 ; off-sheet PL_KEY2
PL_KEY3: J3.104 ; off-sheet PL_KEY3
PL_LED1: J3.86 ; off-sheet PL_LED1
PL_LED2: J3.88 ; off-sheet PL_LED2
PL_LED3: J3.92 ; off-sheet PL_LED3
PS_MIO4: J6.3 ; off-sheet PS_MIO4
PS_MIO5: J6.1 ; off-sheet PS_MIO5
PS_POR_B: J5.115 ; off-sheet PS_POR_B
SD_CLK: J6.25 ; off-sheet SD_CLK
SD_CMD: J6.27 ; off-sheet SD_CMD
SD_D0: J6.31 ; off-sheet SD_D0
SD_D1: J6.33 ; off-sheet SD_D1
SD_D2: J6.37 ; off-sheet SD_D2
SD_D3: J6.39 ; off-sheet SD_D3
SD_SEL: J6.19 ; off-sheet SD_SEL
STROBE_1: J3.22 ; off-sheet STROBE_1
STROBE_2: J3.116 ; off-sheet STROBE_2
STROBE_3: J5.39 ; off-sheet STROBE_3
STROBE_4: J6.105 ; off-sheet STROBE_4
SYS_RESET: J5.117 ; off-sheet SYS_RESET
UART_RXD: J6.7 ; off-sheet UART_RXD
UART_TXD: J6.9 ; off-sheet UART_TXD

Not connected (* = marked no-connect by the designer): J3 121* 122*; J4 1* 2* 3* 4* 7* 8* 9* 10* 13* 14* 15* 16* 19* 20* 21* 22* 25* 26* 27* 28* 31* 32* 33* 34* 37* 38* 39* 40* 43* 44* 45* 46* 49* 50* 51* 52* 55* 56* 57* 58* 61* 62* 63* 64* 67* 68* 69* 70* 73* 74* 75* 76* 79* 80* 81* 82* 85* 86* 87* 88* 91* 92* 93* 94* 97* 98* 99* 100* 103* 104* 105* 106* 109* 110* 111* 112* 115* 116* 117* 118* 121* 122*; J5 43* 45* 49* 51* 55* 57* 61* 63* 67* 68* 69* 70* 73* 74 75* 76* 79* 80* 82* 85* 86* 87* 88* 91* 92* 93* 94* 97* 98* 99* 100* 103* 104* 105* 106* 109* 110* 111* 112* 116* 118* 121* 122*; J6 21* 38* 44* 46* 50* 52* 56* 58* 64* 68* 70* 93* 121* 122*

### Notes on the sheet
- 02 ZYNQ CORE POS
- B11_L1_N
  B11_L1_P
  B11_L8_N
  B11_L8_P
  B11_L12_N
  B11_L12_P
  B11_L16_N
  B11_L16_P
  B11_L6_N
  B11_L6_P
  B11_L17_N
  B11_L17_P
  B11_L18_N
  B11_L18_P
  B11_L20_N
  B11_L20_P
  B10_L17_P
  B10_L17_N
  B10_L15_P
  B10_L15_N
  B10_L6_P
  B10_L6_N
  B10_L24_N
  B10_L24_P
  B10_L5_N
  B10_L5_P
  B10_L23_P
  B10_L23_N
  B10_L12_P
  B10_L12_N
  B10_L22_P
  B10_L22_N
  B10_L3_P
  B10_L3_N
  B10_L11_N
  B10_L11_P
  B10_L9_P
  B10_L9_N
  B10_L21_N
  B10_L21_P
- B11_L4_N
  B11_L4_P
  B11_L3_P
  B11_L3_N
  B11_L2_N
  B11_L2_P
  B11_L5_N
  B11_L5_P
  B11_L15_P
  B11_L15_N
  B11_L13_N
  B11_L13_P
  B11_L14_N
  B11_L14_P
  B11_L19_P
  B11_L19_N
  B10_L13_P
  B10_L13_N
  B10_L2_P
  B10_L2_N
  B10_L4_P
  B10_L4_N
  B10_L16_P
  B10_L16_N
  B10_L20_P
  B10_L20_N
  B10_L18_P
  B10_L18_N
  B10_L14_N
  B10_L14_P
  B10_L1_P
  B10_L1_N
  B10_L8_P
  B10_L8_N
  B10_L10_N
  B10_L10_P
  B10_L7_N
  B10_L7_P
  B10_L19_P
  B10_L19_N
- FPGA_TCK
  FPGA_TMS
  B35_L2_P
  B35_L2_N
  B35_L9_P
  B35_L9_N
  B35_L22_N
  B35_L22_P
  B35_L20_N
  B35_L20_P
  B35_L19_N
  B35_L19_P
  B35_L24_N
  B35_L24_P
  B35_L4_N
  B35_L4_P
  B35_L1_N
  B35_L1_P
  B35_L16_N
  B35_L16_P
  B35_L18_N
  B35_L18_P
  B35_L15_N
  B35_L15_P
  B35_L7_N
  B35_L7_P
  B35_L6_N
  B35_L6_P
  PS_POR_B
  SYS_RESET
- FPGA_TDI
  FPGA_TDO
  B35_L8_N
  B35_L8_P
  B35_L3_N
  B35_L3_P
  B35_L5_P
  B35_L5_N
  B35_L10_P
  B35_L10_N
  B35_L12_N
  B35_L12_P
  B35_L11_N
  B35_L11_P
  B35_L23_P
  B35_L23_N
  B35_L21_P
  B35_L21_N
  B35_L14_P
  B35_L14_N
  B35_L13_N
  B35_L13_P
  B35_L17_N
  B35_L17_P
- PS_MIO5
  PS_MIO4
  PS_MIO14
  PS_MIO15
  PS_MIO52
  PS_MIO53
  PS_MIO7
  PS_MIO40
  PS_MIO41
  PS_MIO42
  PS_MIO43
  PS_MIO44
  PS_MIO45
  B12_L2_N
  B12_L2_P
  B12_L4_N
  B12_L4_P
  B12_L19_P
  B12_L19_N
  B12_L3_P
  B12_L3_N
  B12_L5_P
  B12_L5_N
  B12_L8_N
  B12_L8_P
  B12_L15_N
  B12_L15_P
  B12_L23_N
  B12_L23_P
  B11_L21_N
  B11_L21_P
  B11_L22_N
  B11_L22_P
  B11_L7_P
  B11_L7_N
- PS_MIO17
  PS_MIO18
  PS_MIO19
  PS_MIO20
  PS_MIO16
  PS_MIO21
  PS_MIO26
  PS_MIO25
  PS_MIO24
  PS_MIO23
  PS_MIO27
  PS_MIO22
  PS_MIO30
  PS_MIO29
  PS_MIO36
  PS_MIO31
  PS_MIO32
  PS_MIO33
  PS_MIO34
  PS_MIO35
  PS_MIO28
  PS_MIO37
  PS_MIO38
  PS_MIO39
  B12_L21_P
  B12_L21_N
  B12_L7_N
  B12_L7_P
  B11_L11_P
  B11_L11_N
  B11_L9_P
  B11_L9_N
  B11_L10_N
  B11_L10_P
  B11_L24_P
  B11_L24_N

### Library data of the parts
J3-J6 = 120pin

## Sheet 03_ZYNQ_JTAG_BOOT.SchDoc
size 297 x 209 mm; SheetNumber: 3; SheetTotal: 7
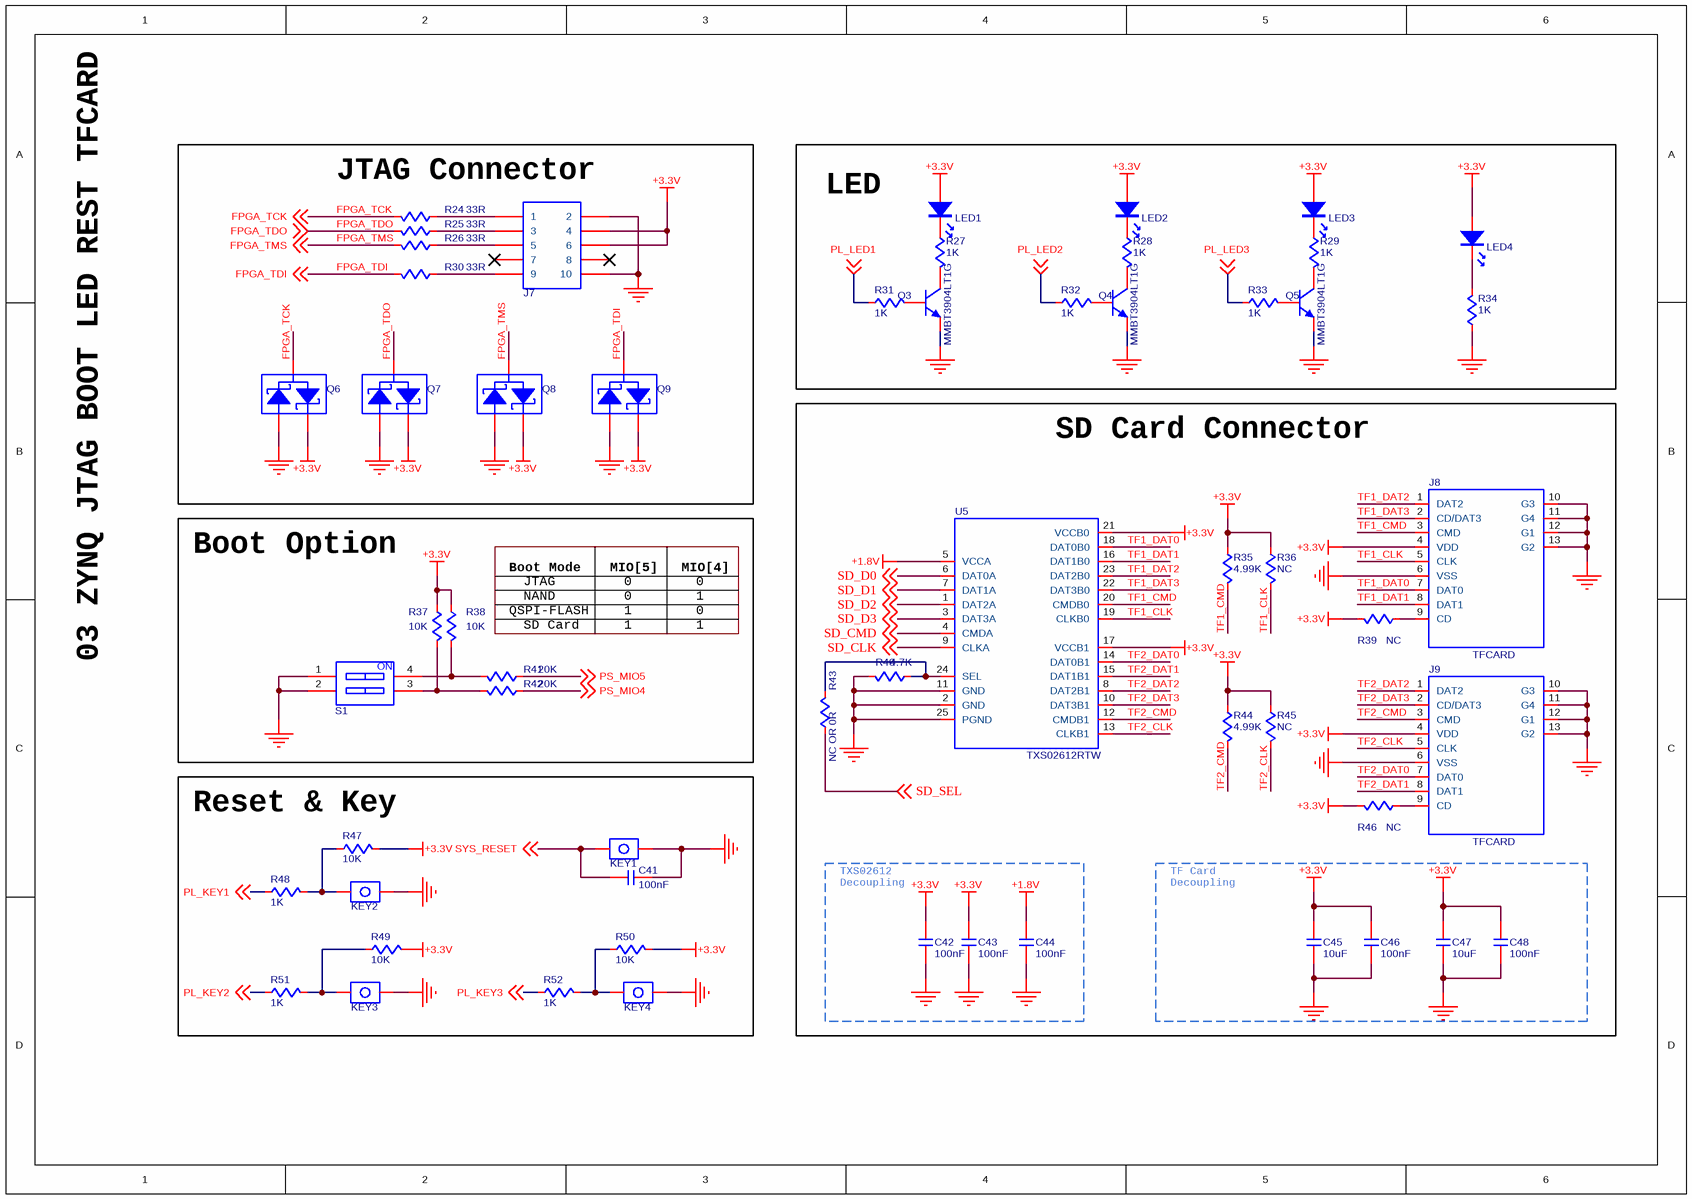
[diagram p5: 03_ZYNQ_JTAG_BOOT.SchDoc]

### Parts
C41  value 100nF  [C0402]  (hidden comment: C-NOMO)
C42  value 100nF  [C0402]  (hidden comment: C-NOMO)
C43  value 100nF  [C0402]  (hidden comment: C-NOMO)
C44  value 100nF  [C0402]  (hidden comment: C-NOMO)
C45  value 10uF  [C0805]  (hidden comment: C-NOMO)
C46  value 100nF  [C0402]  (hidden comment: C-NOMO)
C47  value 10uF  [C0805]  (hidden comment: C-NOMO)
C48  value 100nF  [C0402]  (hidden comment: C-NOMO)
J7  HDR2X5  [HDR2X5-NJ]  (value not drawn)
J8  TFCARD  [TFCARD]
J9  TFCARD  [TFCARD]
KEY1  KEY  [KEY735SO]  (value not drawn)
KEY2  KEY  [KEY735SO]  (value not drawn)
KEY3  KEY  [KEY735SO]  (value not drawn)
KEY4  KEY  [KEY735SO]  (value not drawn)
LED1  LED  [LED0603]  (value not drawn)
LED2  LED  [LED0603]  (value not drawn)
LED3  LED  [LED0603]  (value not drawn)
LED4  LED  [LED0603]  (value not drawn)
Q3  MMBT3904LT1G  [SOT-23]
Q4  MMBT3904LT1G  [SOT-23]
Q5  MMBT3904LT1G  [SOT-23]
Q6  BAT54S  [SOT-23]  (value not drawn)
Q7  BAT54S  [SOT-23]  (value not drawn)
Q8  BAT54S  [SOT-23]  (value not drawn)
Q9  BAT54S  [SOT-23]  (value not drawn)
R24  value 33R  [R0402]  (hidden comment: R)
R25  value 33R  [R0402]  (hidden comment: R)
R26  value 33R  [R0402]  (hidden comment: R)
R27  value 1K  [R0402]  (hidden comment: R)
R28  value 1K  [R0402]  (hidden comment: R)
R29  value 1K  [R0402]  (hidden comment: R)
R30  value 33R  [R0402]  (hidden comment: R)
R31  value 1K  [R0402]  (hidden comment: R)
R32  value 1K  [R0402]  (hidden comment: R)
R33  value 1K  [R0402]  (hidden comment: R)
R34  value 1K  [R0402]  (hidden comment: R)
R35  value 4.99K  [R0402]  (hidden comment: R)
R36  value NC  [R0402]  (hidden comment: R)
R37  value 10K  [R0402]  (hidden comment: R)
R38  value 10K  [R0402]  (hidden comment: R)
R39  value NC  [R0402]  (hidden comment: R)
R40  value 4.7K  [R0402]  (hidden comment: R)
R41  value 20K  [R0402]  (hidden comment: R)
R42  value 20K  [R0402]  (hidden comment: R)
R43  value NC OR 0R  [R0402]  (hidden comment: R)
R44  value 4.99K  [R0402]  (hidden comment: R)
R45  value NC  [R0402]  (hidden comment: R)
R46  value NC  [R0402]  (hidden comment: R)
R47  value 10K  [R0402]  (hidden comment: R)
R48  value 1K  [R0402]  (hidden comment: R)
R49  value 10K  [R0402]  (hidden comment: R)
R50  value 10K  [R0402]  (hidden comment: R)
R51  value 1K  [R0402]  (hidden comment: R)
R52  value 1K  [R0402]  (hidden comment: R)
S1  Switch  [DHN02VTR]  (value not drawn)
U5  TXS02612RTW  [TXS02612TWR]

### Blocks framed on the sheet
JTAG Connector: J7 Q6-Q9 R24-R26 R30
LED: LED1-LED4 Q3-Q5 R27-R29 R31-R34
SD Card Connector: C42-C48 J8 J9 R35 R36 R39 R40 R43-R46 U5
Boot Option: R37 R38 R41 R42 S1
Reset & Key: C41 KEY1-KEY4 R47-R52

### Nets
+1.8V: C44.2 U5.5(VCCA)
+3.3V: C42.2 C43.2 C45.2 C46.2 C47.2 C48.2 J7.4 J7.6 J8.4(VDD) J9.4(VDD) LED1.2 LED2.2 LED3.2 LED4.2 Q6.2 Q7.2 Q8.2 Q9.2 R35.2 R36.2 R37.2 R38.2 R39.1 R44.2 R45.2 R46.1 R47.1 R49.1 R50.1 U5.17(VCCB1) U5.21(VCCB0)
GND: C41.2 C42.1 C43.1 C44.1 C45.1 C46.1 C47.1 C48.1 J7.2 J7.10 J8.6(VSS) J8.10(G3) J8.11(G4) J8.12(G1) J8.13(G2) J9.6(VSS) J9.10(G3) J9.11(G4) J9.12(G1) J9.13(G2) KEY1.2 KEY2.2 KEY3.2 KEY4.2 Q3.2(E) Q4.2(E) Q5.2(E) Q6.1 Q7.1 Q8.1 Q9.1 R34.2 R40.1 S1.1(A1) S1.2(A2) U5.2(GND) U5.11(GND) U5.25(PGND)
FPGA_TCK: Q6.3 R24.1 ; off-sheet FPGA_TCK
FPGA_TDI: Q9.3 R30.1 ; off-sheet FPGA_TDI
FPGA_TDO: Q7.3 R25.1 ; off-sheet FPGA_TDO
FPGA_TMS: Q8.3 R26.1 ; off-sheet FPGA_TMS
PL_KEY1: R48.2 ; off-sheet PL_KEY1
PL_KEY2: R51.2 ; off-sheet PL_KEY2
PL_KEY3: R52.2 ; off-sheet PL_KEY3
PL_LED1: R31.2 ; off-sheet PL_LED1
PL_LED2: R32.2 ; off-sheet PL_LED2
PL_LED3: R33.2 ; off-sheet PL_LED3
PS_MIO4: R42.2 ; off-sheet PS_MIO4
PS_MIO5: R41.2 ; off-sheet PS_MIO5
SD_CLK: U5.9(CLKA) ; off-sheet SD_CLK
SD_CMD: U5.4(CMDA) ; off-sheet SD_CMD
SD_D0: U5.6(DAT0A) ; off-sheet SD_D0
SD_D1: U5.7(DAT1A) ; off-sheet SD_D1
SD_D2: U5.1(DAT2A) ; off-sheet SD_D2
SD_D3: U5.3(DAT3A) ; off-sheet SD_D3
SD_SEL: R43.2 ; off-sheet SD_SEL
SYS_RESET: C41.1 KEY1.1 ; off-sheet SYS_RESET
TF1_CLK: J8.5(CLK) R36.1 U5.19(CLKB0)
TF1_CMD: J8.3(CMD) R35.1 U5.20(CMDB0)
TF1_DAT0: J8.7(DAT0) U5.18(DAT0B0)
TF1_DAT1: J8.8(DAT1) U5.16(DAT1B0)
TF1_DAT2: J8.1(DAT2) U5.23(DAT2B0)
TF1_DAT3: J8.2(CD/DAT3) U5.22(DAT3B0)
TF2_CLK: J9.5(CLK) R45.1 U5.13(CLKB1)
TF2_CMD: J9.3(CMD) R44.1 U5.12(CMDB1)
TF2_DAT0: J9.7(DAT0) U5.14(DAT0B1)
TF2_DAT1: J9.8(DAT1) U5.15(DAT1B1)
TF2_DAT2: J9.1(DAT2) U5.8(DAT2B1)
TF2_DAT3: J9.2(CD/DAT3) U5.10(DAT3B1)
NetJ7_1: J7.1 R24.2
NetJ7_3: J7.3 R25.2
NetJ7_5: J7.5 R26.2
NetJ7_9: J7.9 R30.2
NetJ8_9: J8.9(CD) R39.2
NetJ9_9: J9.9(CD) R46.2
NetKEY2_1: KEY2.1 R47.2 R48.1
NetKEY3_1: KEY3.1 R49.2 R51.1
NetKEY4_1: KEY4.1 R50.2 R52.1
NetLED1_1: LED1.1 R27.2
NetLED2_1: LED2.1 R28.2
NetLED3_1: LED3.1 R29.2
NetLED4_1: LED4.1 R34.1
NetQ3_1: Q3.1(B) R31.1
NetQ3_3: Q3.3(C) R27.1
NetQ4_1: Q4.1(B) R32.1
NetQ4_3: Q4.3(C) R28.1
NetQ5_1: Q5.1(B) R33.1
NetQ5_3: Q5.3(C) R29.1
NetR37_1: R37.1 R42.1 S1.3(B2)
NetR38_1: R38.1 R41.1 S1.4(B1)
NetR40_2: R40.2 R43.1 U5.24(SEL)

Not connected (* = marked no-connect by the designer): J7 7* 8*

### Notes on the sheet
- Boot Mode
- MIO[5]
- MIO[4]
- QSPI-FLASH
- JTAG
- NAND
- SD Card
- 0
- 1
- 03 ZYNQ JTAG BOOT LED REST TFCARD
- TXS02612 Decoupling
- TF Card Decoupling
- (in symbol SW-2) ON

### Library data of the parts
C41-C48 = C-NOMO: voltage: 25V; precision: 5%
Q3-Q5 = NPN
R24-R52 = R: precision: 1%
S1 = SW-2

## Sheet 04_ZYNQ_MISC_INTERFACE.SchDoc
size 420 x 297 mm; SheetNumber: 4; SheetTotal: 7
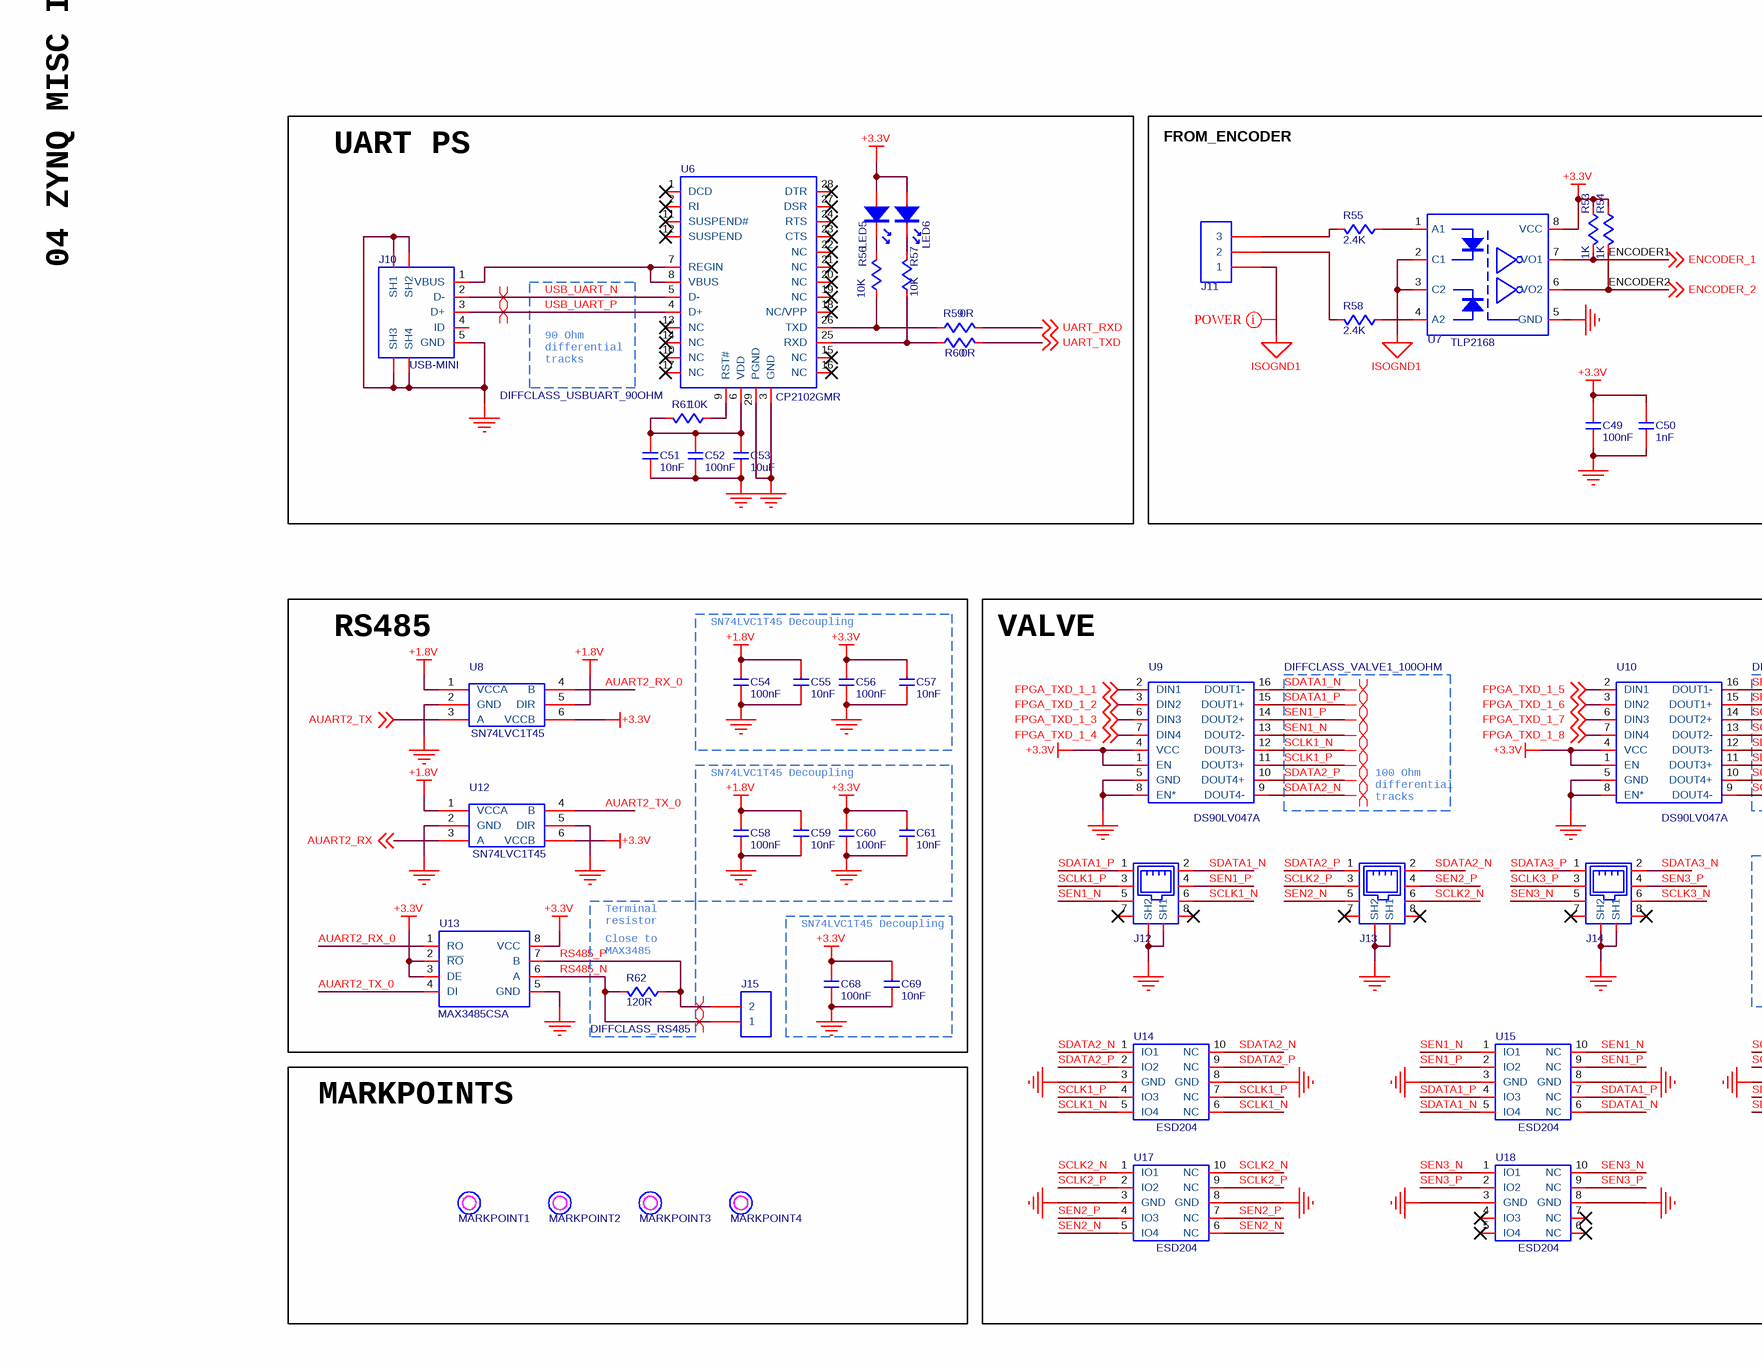
[diagram p6: 04_ZYNQ_MISC_INTERFACE.SchDoc, left]
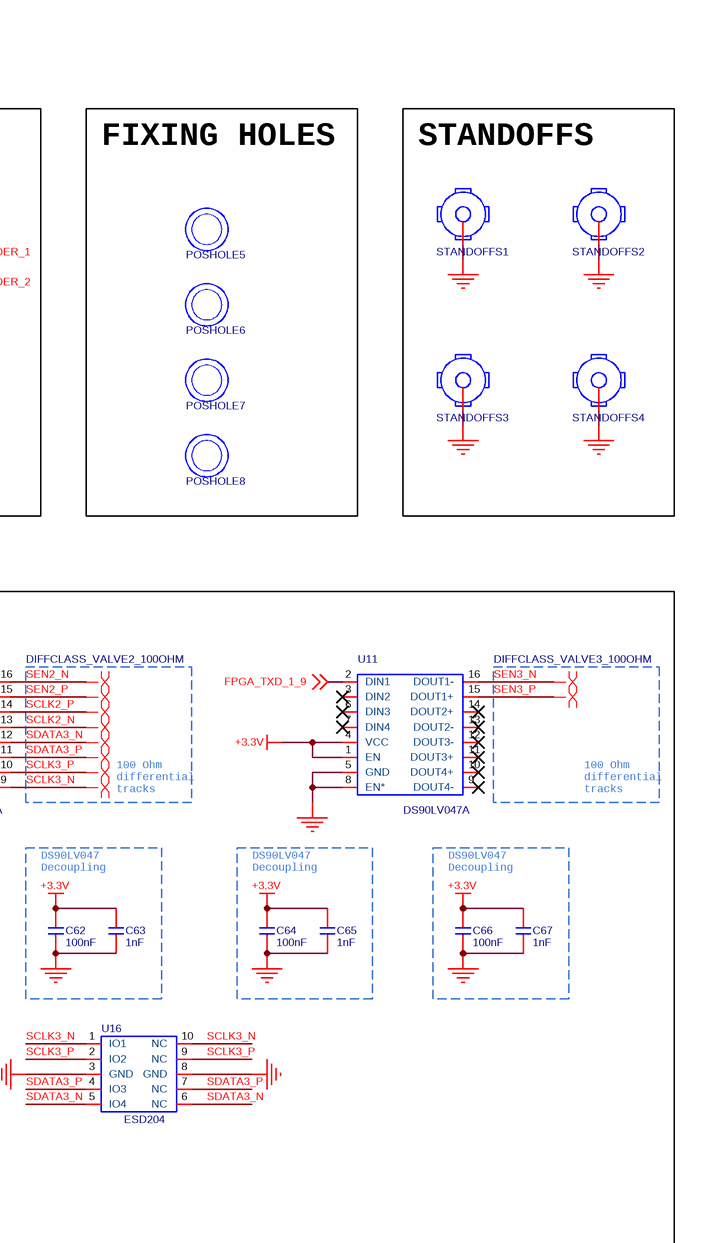
[diagram p7: 04_ZYNQ_MISC_INTERFACE.SchDoc, right]

### Parts
C49  value 100nF  [C0402]  (hidden comment: C-NOMO)
C50  value 1nF  [C0402]  (hidden comment: C-NOMO)
C51  value 10nF  [C0402]  (hidden comment: C-NOMO)
C52  value 100nF  [C0402]  (hidden comment: C-NOMO)
C53  value 10uF  [C0805]  (hidden comment: C-NOMO)
C54  value 100nF  [C0402]  (hidden comment: C-NOMO)
C55  value 10nF  [C0402]  (hidden comment: C-NOMO)
C56  value 100nF  [C0402]  (hidden comment: C-NOMO)
C57  value 10nF  [C0402]  (hidden comment: C-NOMO)
C58  value 100nF  [C0402]  (hidden comment: C-NOMO)
C59  value 10nF  [C0402]  (hidden comment: C-NOMO)
C60  value 100nF  [C0402]  (hidden comment: C-NOMO)
C61  value 10nF  [C0402]  (hidden comment: C-NOMO)
C62  value 100nF  [C0402]  (hidden comment: C-NOMO)
C63  value 1nF  [C0402]  (hidden comment: C-NOMO)
C64  value 100nF  [C0402]  (hidden comment: C-NOMO)
C65  value 1nF  [C0402]  (hidden comment: C-NOMO)
C66  value 100nF  [C0402]  (hidden comment: C-NOMO)
C67  value 1nF  [C0402]  (hidden comment: C-NOMO)
C68  value 100nF  [C0402]  (hidden comment: C-NOMO)
C69  value 10nF  [C0402]  (hidden comment: C-NOMO)
J10  USB-MINI  [USB-MINI]
J11  HDR1X3  [KF301-5.0-3P]  (value not drawn)
J12  RJ45-UP  [RJ45-UP]  (value not drawn)
J13  RJ45-UP  [RJ45-UP]  (value not drawn)
J14  RJ45-UP  [RJ45-UP]  (value not drawn)
J15  HDR1X2  [KF301-5.0-2P]  (value not drawn)
LED5  LED  [LED0603]  (value not drawn)
LED6  LED  [LED0603]  (value not drawn)
MARKPOINT1  MARKPOINT  [MARKPOINT-1.0]  (value not drawn)
MARKPOINT2  MARKPOINT  [MARKPOINT-1.0]  (value not drawn)
MARKPOINT3  MARKPOINT  [MARKPOINT-1.0]  (value not drawn)
MARKPOINT4  MARKPOINT  [MARKPOINT-1.0]  (value not drawn)
POSHOLE5  POSHOLE  [POSHOLE-3.2]  (value not drawn)
POSHOLE6  POSHOLE  [POSHOLE-3.2]  (value not drawn)
POSHOLE7  POSHOLE  [POSHOLE-3.2]  (value not drawn)
POSHOLE8  POSHOLE  [POSHOLE-3.2]  (value not drawn)
R53  value 1K  [R0402]  (hidden comment: R)
R54  value 1K  [R0402]  (hidden comment: R)
R55  value 2.4K  [R2512]  (hidden comment: R)
R56  value 10K  [R0402]  (hidden comment: R)
R57  value 10K  [R0402]  (hidden comment: R)
R58  value 2.4K  [R2512]  (hidden comment: R)
R59  value 0R  [R0402]  (hidden comment: R)
R60  value 0R  [R0402]  (hidden comment: R)
R61  value 10K  [R0402]  (hidden comment: R)
R62  value 120R  [R0402]  (hidden comment: R)
STANDOFFS1  STANDOFFS  [STANDOFFS-5-2.5]  (value not drawn)
STANDOFFS2  STANDOFFS  [STANDOFFS-5-2.5]  (value not drawn)
STANDOFFS3  STANDOFFS  [STANDOFFS-5-2.5]  (value not drawn)
STANDOFFS4  STANDOFFS  [STANDOFFS-5-2.5]  (value not drawn)
U6  CP2102GMR  [CP2102GMR]
U7  TLP2168  [TLP2168]
U8  SN74LVC1T45  [SN74LVC1T45]
U9  DS90LV047A  [DS90LV047]
U10  DS90LV047A  [DS90LV047]
U11  DS90LV047A  [DS90LV047]
U12  SN74LVC1T45  [SN74LVC1T45]
U13  MAX3485CSA  [MAX3485CSA]
U14  ESD204  [ESD204]
U15  ESD204  [ESD204]
U16  ESD204  [ESD204]
U17  ESD204  [ESD204]
U18  ESD204  [ESD204]

### Blocks framed on the sheet
UART PS: C51-C53 J10 LED5 LED6 R56 R57 R59-R61 U6
FROM_ENCODER: C49 C50 J11 R53-R55 R58 U7
FIXING HOLES: POSHOLE5-POSHOLE8
STANDOFFS: STANDOFFS1-STANDOFFS4
RS485: C54-C61 C68 C69 J15 R62 U8 U12 U13
VALVE: C62-C67 J12-J14 U9-U11 U14-U18
MARKPOINTS: MARKPOINT1-MARKPOINT4

### Nets
+1.8V: C54.1 C55.2 C58.1 C59.2 U8.1(VCCA) U8.5(DIR) U12.1(VCCA)
+3.3V: C49.2 C50.2 C56.1 C57.2 C60.1 C61.2 C62.1 C63.2 C64.1 C65.2 C66.1 C67.2 C68.1 C69.2 LED5.2 LED6.2 R53.2 R54.2 U7.8(VCC) U8.6(VCCB) U9.1(EN) U9.4(VCC) U10.1(EN) U10.4(VCC) U11.1(EN) U11.4(VCC) U12.6(VCCB) U13.2(~{RO}) U13.3(DE) U13.8(VCC)
GND: C49.1 C50.1 C51.1 C52.1 C53.2 C54.2 C55.1 C56.2 C57.1 C58.2 C59.1 C60.2 C61.1 C62.2 C63.1 C64.2 C65.1 C66.2 C67.1 C68.2 C69.1 J10.5(GND) J10.SH1 J10.SH2 J10.SH3 J10.SH4 J12.SH1 J12.SH2 J13.SH1 J13.SH2 J14.SH1 J14.SH2 STANDOFFS1.0 STANDOFFS2.0 STANDOFFS3.0 STANDOFFS4.0 U6.3(GND) U6.29(PGND) U7.5(GND) U8.2(GND) U9.5(GND) U9.8(EN*) U10.5(GND) U10.8(EN*) U11.5(GND) U11.8(EN*) U12.2(GND) U12.5(DIR) U13.5(GND) U14.3(GND) U14.8(GND) U15.3(GND) U15.8(GND) U16.3(GND) U16.8(GND) U17.3(GND) U17.8(GND) U18.3(GND) U18.8(GND)
ISOGND1: J11.1 U7.2(C1) U7.3(C2)
AUART2_RX: U12.3(A) ; off-sheet AUART2_RX
AUART2_RX_0: U8.4(B) U13.1(RO)
AUART2_TX: U8.3(A) ; off-sheet AUART2_TX
AUART2_TX_0: U12.4(B) U13.4(DI)
ENCODER_1: R53.1 U7.7(VO1) ; off-sheet ENCODER_1
ENCODER_2: R54.1 U7.6(VO2) ; off-sheet ENCODER_2
FPGA_TXD_1_1: U9.2(DIN1) ; off-sheet FPGA_TXD_1_1
FPGA_TXD_1_2: U9.3(DIN2) ; off-sheet FPGA_TXD_1_2
FPGA_TXD_1_3: U9.6(DIN3) ; off-sheet FPGA_TXD_1_3
FPGA_TXD_1_4: U9.7(DIN4) ; off-sheet FPGA_TXD_1_4
FPGA_TXD_1_5: U10.2(DIN1) ; off-sheet FPGA_TXD_1_5
FPGA_TXD_1_6: U10.3(DIN2) ; off-sheet FPGA_TXD_1_6
FPGA_TXD_1_7: U10.6(DIN3) ; off-sheet FPGA_TXD_1_7
FPGA_TXD_1_8: U10.7(DIN4) ; off-sheet FPGA_TXD_1_8
FPGA_TXD_1_9: U11.2(DIN1) ; off-sheet FPGA_TXD_1_9
RS485_N: J15.1 R62.1 U13.6(A)
RS485_P: J15.2 R62.2 U13.7(B)
SCLK1_N: J12.6 U9.12(DOUT3-) U14.5(IO4) U14.6(NC)
SCLK1_P: J12.3 U9.11(DOUT3+) U14.4(IO3) U14.7(NC)
SCLK2_N: J13.6 U10.13(DOUT2-) U17.1(IO1) U17.10(NC)
SCLK2_P: J13.3 U10.14(DOUT2+) U17.2(IO2) U17.9(NC)
SCLK3_N: J14.6 U10.9(DOUT4-) U16.1(IO1) U16.10(NC)
SCLK3_P: J14.3 U10.10(DOUT4+) U16.2(IO2) U16.9(NC)
SDATA1_N: J12.2 U9.16(DOUT1-) U15.5(IO4) U15.6(NC)
SDATA1_P: J12.1 U9.15(DOUT1+) U15.4(IO3) U15.7(NC)
SDATA2_N: J13.2 U9.9(DOUT4-) U14.1(IO1) U14.10(NC)
SDATA2_P: J13.1 U9.10(DOUT4+) U14.2(IO2) U14.9(NC)
SDATA3_N: J14.2 U10.12(DOUT3-) U16.5(IO4) U16.6(NC)
SDATA3_P: J14.1 U10.11(DOUT3+) U16.4(IO3) U16.7(NC)
SEN1_N: J12.5 U9.13(DOUT2-) U15.1(IO1) U15.10(NC)
SEN1_P: J12.4 U9.14(DOUT2+) U15.2(IO2) U15.9(NC)
SEN2_N: J13.5 U10.16(DOUT1-) U17.5(IO4) U17.6(NC)
SEN2_P: J13.4 U10.15(DOUT1+) U17.4(IO3) U17.7(NC)
SEN3_N: J14.5 U11.16(DOUT1-) U18.1(IO1) U18.10(NC)
SEN3_P: J14.4 U11.15(DOUT1+) U18.2(IO2) U18.9(NC)
UART_RXD: R59.1 ; off-sheet UART_RXD
UART_TXD: R60.1 ; off-sheet UART_TXD
USB_UART_N: J10.2(D-) U6.5(D-)
USB_UART_P: J10.3(D+) U6.4(D+)
NetC51_2: C51.2 C52.2 C53.1 R61.1 U6.6(VDD)
NetJ10_1: J10.1(VBUS) U6.7(REGIN) U6.8(VBUS)
NetJ11_2: J11.2 R58.1
NetJ11_3: J11.3 R55.1
NetLED5_1: LED5.1 R56.1
NetLED6_1: LED6.1 R57.1
NetR55_2: R55.2 U7.1(A1)
NetR56_2: R56.2 R59.2 U6.26(TXD)
NetR57_2: R57.2 R60.2 U6.25(RXD)
NetR58_2: R58.2 U7.4(A2)
NetR61_2: R61.2 U6.9(RST#)

Not connected (* = marked no-connect by the designer): J10 4(ID); J12 7* 8*; J13 7* 8*; J14 7* 8*; U6 1(DCD)* 2(RI)* 10(NC)* 11(SUSPEND#)* 12(SUSPEND)* 13(NC)* 14(NC)* 15(NC)* 16(NC)* 17(NC)* 18(NC/VPP)* 19(NC)* 20(NC)* 21(NC)* 22(NC)* 23(CTS)* 24(RTS)* 27(DSR)* 28(DTR)*; U11 3(DIN2)* 6(DIN3)* 7(DIN4)* 9(DOUT4-)* 10(DOUT4+)* 11(DOUT3+)* 12(DOUT3-)* 13(DOUT2-)* 14(DOUT2+)*; U18 4(IO3)* 5(IO4)* 6(NC)* 7(NC)*

### Layout directives
differential pair; differential pair class DIFFCLASS_RS485: RS485_N, RS485_P
differential pair; differential pair class DIFFCLASS_USBUART_90OHM: USB_UART_N, USB_UART_P
differential pair; differential pair class DIFFCLASS_VALVE1_100OHM: SCLK1_N, SCLK1_P, SDATA1_N, SDATA1_P, SEN1_N, SEN1_P
differential pair; differential pair class DIFFCLASS_VALVE2_100OHM: SCLK2_N, SCLK2_P, SDATA2_N, SDATA2_P, SEN2_N, SEN2_P
differential pair; differential pair class DIFFCLASS_VALVE3_100OHM: SCLK3_N, SCLK3_P, SDATA3_N, SDATA3_P, SEN3_N, SEN3_P
net class POWER: ISOGND1

### Notes on the sheet
- (near R54) ENCODER1
- 04 ZYNQ MISC INTEFACE
- ENCODER2
- 90 Ohm differential tracks
- SN74LVC1T45 Decoupling
- 100 Ohm differential tracks
- Terminal resistor
- DS90LV047 Decoupling
- (near R62) Close to MAX3485

### Library data of the parts
C49-C69 = C-NOMO: voltage: 25V; precision: 5%
R53-R62 = R: precision: 1%
J11 = HDR1X3: Supplier 1: LCSC; Supplier Part Number 1: C474884; Supplier 2: LCSC; Supplier Part Number 2: C609572
J12-J14 = RJ45-UP: Supplier 1: LCSC; Supplier Part Number 1: C2683357
U14-U18 = ESD204: Supplier 1: LCSC; Supplier Part Number 1: C553132

## Sheet 05_ZYNQ_ETHERNET.SchDoc
size 420 x 297 mm; SheetNumber: 5; SheetTotal: 7
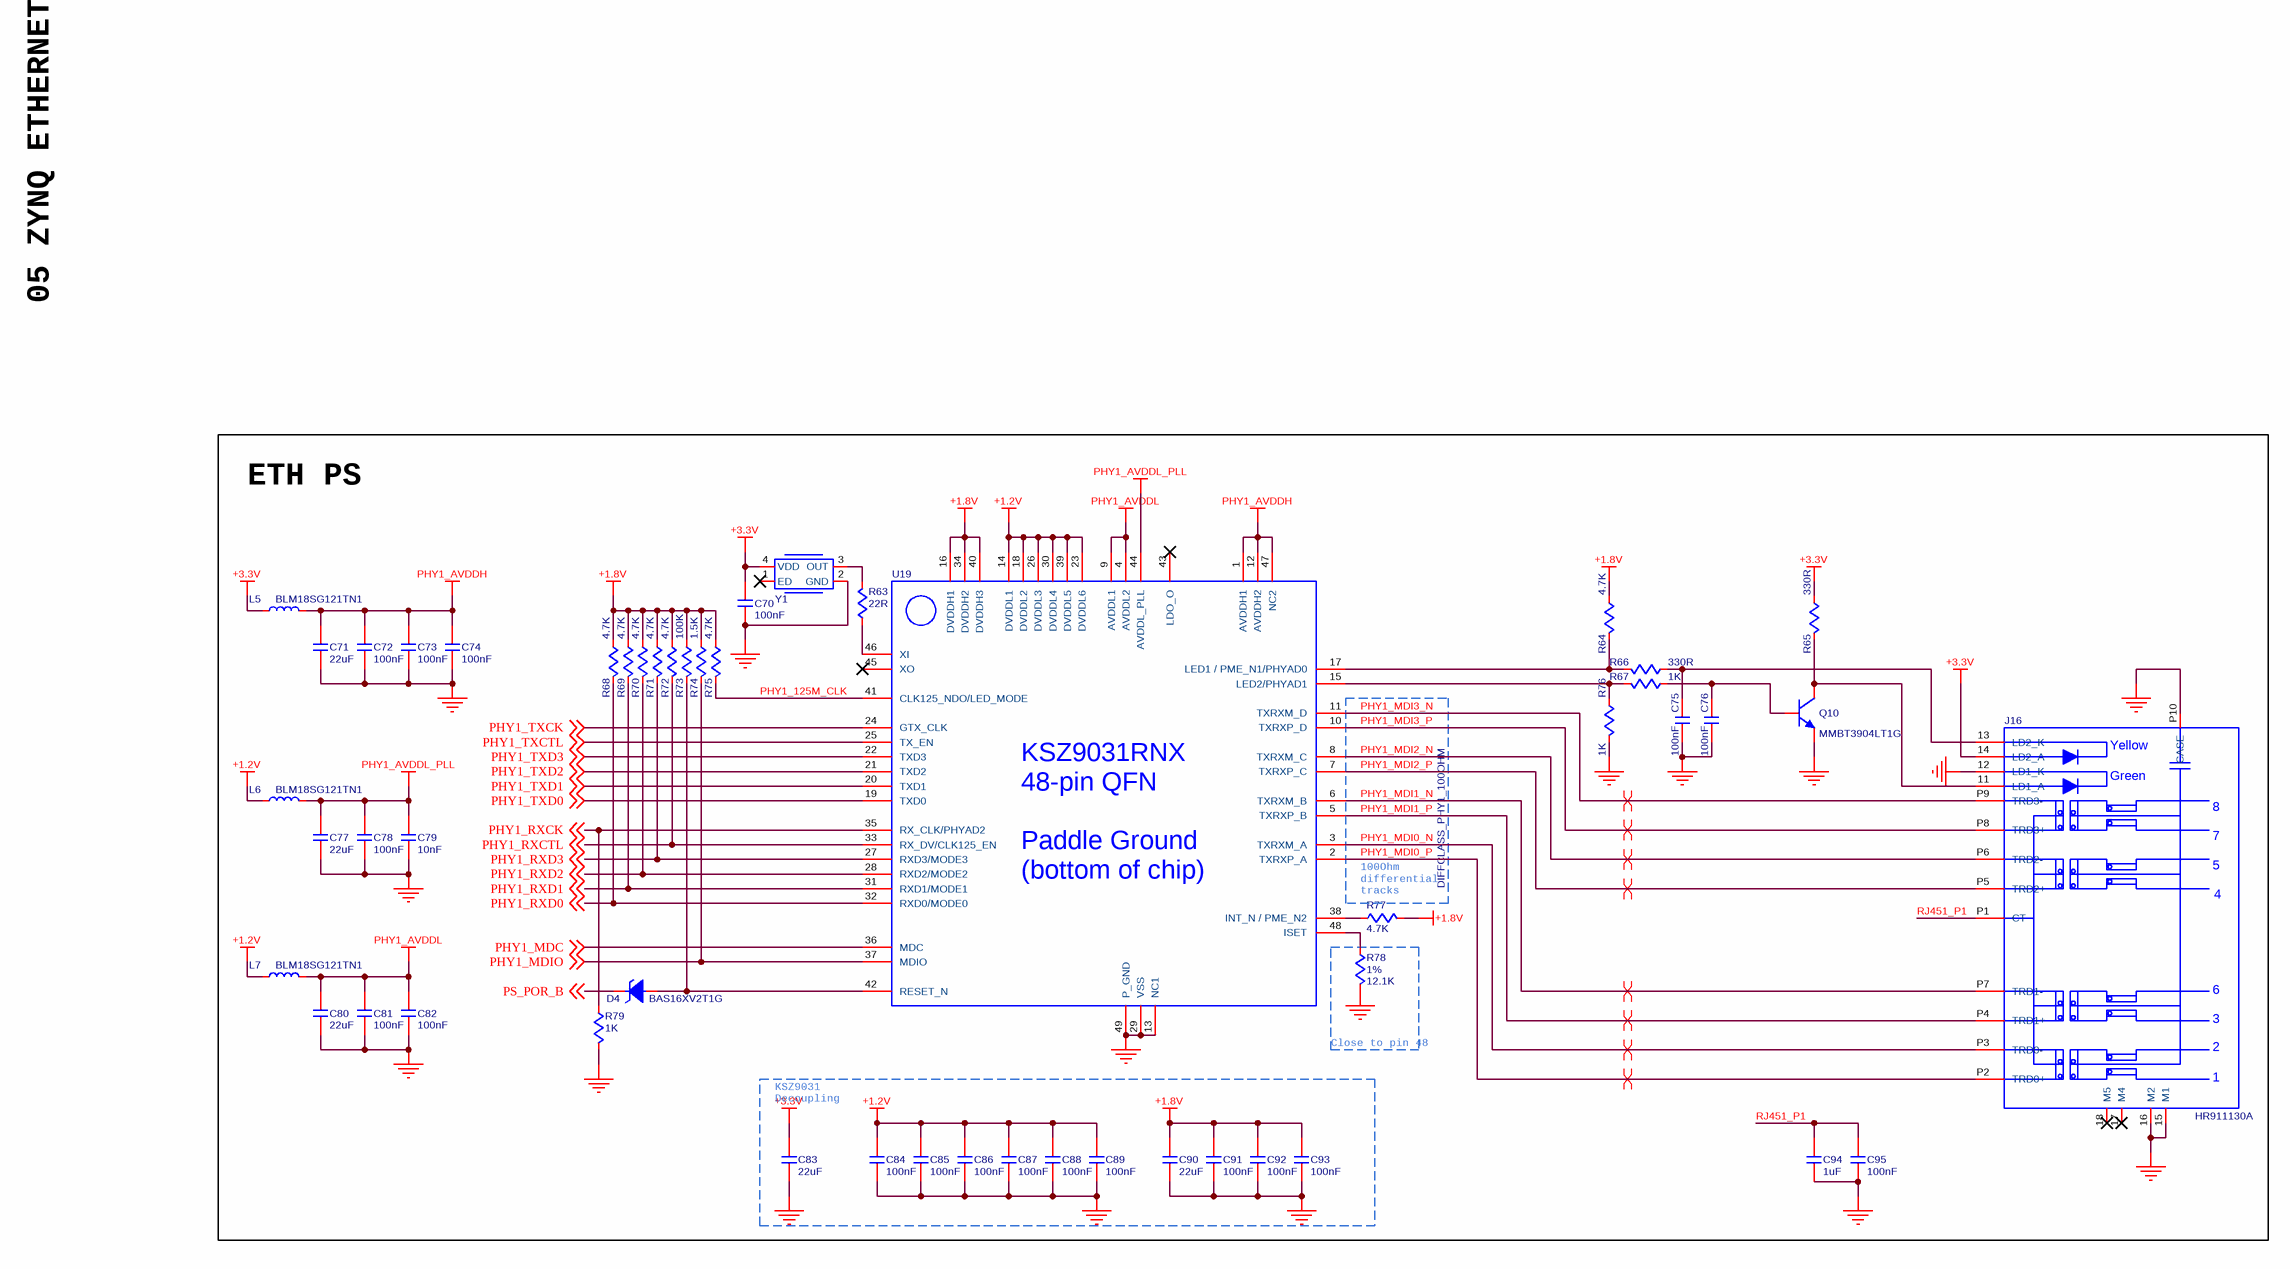
[diagram p8: 05_ZYNQ_ETHERNET.SchDoc]

### Parts
C70  value 100nF  [C0402]  (hidden comment: C-NOMO)
C71  value 22uF  [C0805]  (hidden comment: C-NOMO)
C72  value 100nF  [C0402]  (hidden comment: C-NOMO)
C73  value 100nF  [C0402]  (hidden comment: C-NOMO)
C74  value 100nF  [C0402]  (hidden comment: C-NOMO)
C75  value 100nF  [C0402]  (hidden comment: C-NOMO)
C76  value 100nF  [C0402]  (hidden comment: C-NOMO)
C77  value 22uF  [C0805]  (hidden comment: C-NOMO)
C78  value 100nF  [C0402]  (hidden comment: C-NOMO)
C79  value 10nF  [C0402]  (hidden comment: C-NOMO)
C80  value 22uF  [C0805]  (hidden comment: C-NOMO)
C81  value 100nF  [C0402]  (hidden comment: C-NOMO)
C82  value 100nF  [C0402]  (hidden comment: C-NOMO)
C83  value 22uF  [C0805]  (hidden comment: C-NOMO)
C84  value 100nF  [C0402]  (hidden comment: C-NOMO)
C85  value 100nF  [C0402]  (hidden comment: C-NOMO)
C86  value 100nF  [C0402]  (hidden comment: C-NOMO)
C87  value 100nF  [C0402]  (hidden comment: C-NOMO)
C88  value 100nF  [C0402]  (hidden comment: C-NOMO)
C89  value 100nF  [C0402]  (hidden comment: C-NOMO)
C90  value 22uF  [C0805]  (hidden comment: C-NOMO)
C91  value 100nF  [C0402]  (hidden comment: C-NOMO)
C92  value 100nF  [C0402]  (hidden comment: C-NOMO)
C93  value 100nF  [C0402]  (hidden comment: C-NOMO)
C94  value 1uF  [C0402]  (hidden comment: C-NOMO)
C95  value 100nF  [C0402]  (hidden comment: C-NOMO)
D4  BAS16XV2T1G  [SOD-523]
J16  HR911130A  [RJ45-GE]
L5  BLM18SG121TN1  [L0603]
L6  BLM18SG121TN1  [L0603]
L7  BLM18SG121TN1  [L0603]
Q10  MMBT3904LT1G  [SOT-23]
R63  value 22R  [R0402]  (hidden comment: R)
R64  value 4.7K  [R0402]  (hidden comment: R)
R65  value 330R  [R0402]  (hidden comment: R)
R66  value 330R  [R0402]  (hidden comment: R)
R67  value 1K  [R0402]  (hidden comment: R)
R68  value 4.7K  [R0402]  (hidden comment: R)
R69  value 4.7K  [R0402]  (hidden comment: R)
R70  value 4.7K  [R0402]  (hidden comment: R)
R71  value 4.7K  [R0402]  (hidden comment: R)
R72  value 4.7K  [R0402]  (hidden comment: R)
R73  value 100K  [R0402]  (hidden comment: R)
R74  value 1.5K  [R0402]  (hidden comment: R)
R75  value 4.7K  [R0402]  (hidden comment: R)
R76  value 1K  [R0402]  (hidden comment: R)
R77  value 4.7K  [R0402]  (hidden comment: R)
R78  value 12.1K  precision: 1%  [R0402]  (hidden comment: R)
R79  value 1K  [R0402]  (hidden comment: R)
U19  KSZ9031RNX  [KSZ9031]  (value not drawn)
Y1  XTAL  [OSC3225]  (value not drawn)

### Blocks framed on the sheet
ETH PS: C70-C95 D4 J16 L5-L7 Q10 R63-R79 U19 Y1

### Nets
+1.2V: C84.2 C85.2 C86.2 C87.2 C88.2 C89.2 L6.1 L7.1 U19.14(DVDDL1) U19.18(DVDDL2) U19.23(DVDDL6) U19.26(DVDDL3) U19.30(DVDDL4) U19.39(DVDDL5)
+1.8V: C90.2 C91.2 C92.2 C93.2 R64.2 R68.2 R69.2 R70.2 R71.2 R72.2 R73.2 R74.2 R75.2 R77.1 U19.16(DVDDH1) U19.34(DVDDH2) U19.40(DVDDH3)
+3.3V: C70.2 C83.2 J16.14(LD2_A) L5.1 R65.2 Y1.4(VDD)
GND: C70.1 C71.1 C72.1 C73.1 C74.1 C75.1 C76.1 C77.1 C78.1 C79.1 C80.1 C81.1 C82.1 C83.1 C84.1 C85.1 C86.1 C87.1 C88.1 C89.1 C90.1 C91.1 C92.1 C93.1 C94.1 C95.1 J16.12(LD1_K) J16.15(M1) J16.16(M2) J16.P10(CASE) Q10.2(E) R76.1 R78.1 R79.1 U19.13(NC1) U19.29(VSS) U19.49(P_GND) Y1.2(GND)
PHY1_AVDDH: C71.2 C72.2 C73.2 C74.2 L5.2 U19.1(AVDDH1) U19.12(AVDDH2) U19.47(NC2)
PHY1_AVDDL: C80.2 C81.2 C82.2 L7.2 U19.4(AVDDL2) U19.9(AVDDL1)
PHY1_AVDDL_PLL: C77.2 C78.2 C79.2 L6.2 U19.44(AVDDL_PLL)
PHY1_125M_CLK: R75.1 U19.41(CLK125_NDO/LED_MODE)
PHY1_MDC: U19.36(MDC) ; off-sheet PHY1_MDC
PHY1_MDI0_N: J16.P3(TRD0-) U19.3(TXRXM_A)
PHY1_MDI0_P: J16.P2(TRD0+) U19.2(TXRXP_A)
PHY1_MDI1_N: J16.P7(TRD1-) U19.6(TXRXM_B)
PHY1_MDI1_P: J16.P4(TRD1+) U19.5(TXRXP_B)
PHY1_MDI2_N: J16.P6(TRD2-) U19.8(TXRXM_C)
PHY1_MDI2_P: J16.P5(TRD2+) U19.7(TXRXP_C)
PHY1_MDI3_N: J16.P9(TRD3-) U19.11(TXRXM_D)
PHY1_MDI3_P: J16.P8(TRD3+) U19.10(TXRXP_D)
PHY1_MDIO: R74.1 U19.37(MDIO) ; off-sheet PHY1_MDIO
PHY1_RXCK: R79.2 U19.35(RX_CLK/PHYAD2) ; off-sheet PHY1_RXCK
PHY1_RXCTL: R72.1 U19.33(RX_DV/CLK125_EN) ; off-sheet PHY1_RXCTL
PHY1_RXD0: R68.1 U19.32(RXD0/MODE0) ; off-sheet PHY1_RXD0
PHY1_RXD1: R69.1 U19.31(RXD1/MODE1) ; off-sheet PHY1_RXD1
PHY1_RXD2: R70.1 U19.28(RXD2/MODE2) ; off-sheet PHY1_RXD2
PHY1_RXD3: R71.1 U19.27(RXD3/MODE3) ; off-sheet PHY1_RXD3
PHY1_TXCK: U19.24(GTX_CLK) ; off-sheet PHY1_TXCK
PHY1_TXCTL: U19.25(TX_EN) ; off-sheet PHY1_TXCTL
PHY1_TXD0: U19.19(TXD0) ; off-sheet PHY1_TXD0
PHY1_TXD1: U19.20(TXD1) ; off-sheet PHY1_TXD1
PHY1_TXD2: U19.21(TXD2) ; off-sheet PHY1_TXD2
PHY1_TXD3: U19.22(TXD3) ; off-sheet PHY1_TXD3
PS_POR_B: D4.1 ; off-sheet PS_POR_B
RJ451_P1: C94.2 C95.2 J16.P1(CT)
NetC75_2: C75.2 J16.13(LD2_K) R66.2
NetC76_2: C76.2 Q10.1(B) R67.2
NetD4_2: D4.2 R73.1 U19.42(RESET_N)
NetJ16_11: J16.11(LD1_A) Q10.3(C) R65.1
NetR63_1: R63.1 Y1.3(OUT)
NetR63_2: R63.2 U19.46(XI)
NetR64_1: R64.1 R66.1 U19.17(LED1_/_PME_N1/PHYAD0)
NetR67_1: R67.1 R76.2 U19.15(LED2/PHYAD1)
NetR77_2: R77.2 U19.38(INT_N_/_PME_N2)
NetR78_2: R78.2 U19.48(ISET)

Not connected (* = marked no-connect by the designer): J16 17(M4)* 18(M5)*; U19 43(LDO_O)* 45(XO)*; Y1 1(ED)*

### Layout directives
differential pair; differential pair class DIFFCLASS_PHY1_100OHM: PHY1_MDI0_N, PHY1_MDI0_P, PHY1_MDI1_N, PHY1_MDI1_P, PHY1_MDI2_N, PHY1_MDI2_P, PHY1_MDI3_N, PHY1_MDI3_P

### Notes on the sheet
- 05 ZYNQ ETHERNET
- (near R77) 100Ohm differential tracks
- KSZ9031 Decoupling
- Close to pin 48
- (in symbol KSZ9031RNX) KSZ9031RNX / 48-pin QFN / Paddle Ground / (bottom of chip)
- (in symbol RJ45-GE) Yellow; Green; 8; 7; 5; 4; 6; 3; 2; 1

### Library data of the parts
C70-C95 = C-NOMO: voltage: 25V; precision: 5%
D4 = DIOD2
J16 = RJ45-GE
L5-L7 = L: Code_IEC: 1005; Value: 10mH; Published: 8-Jun-2000; LatestRevisionDate: 29-May-2009; LatestRevisionNote: IPC-7351 Footprint Added.; PackageReference: 0402-A; Publisher: Altium Limited; PackageDescription: Chip Inductor; Code_JEITA: 0402
Q10 = NPN
R63-R77 R79 = R: precision: 1%
Y1 = XTAL: frequency: 25MHZ

## Sheet 06_ZYNQ_CAMERALINK.SchDoc
size 420 x 297 mm; SheetNumber: 6; SheetTotal: 7
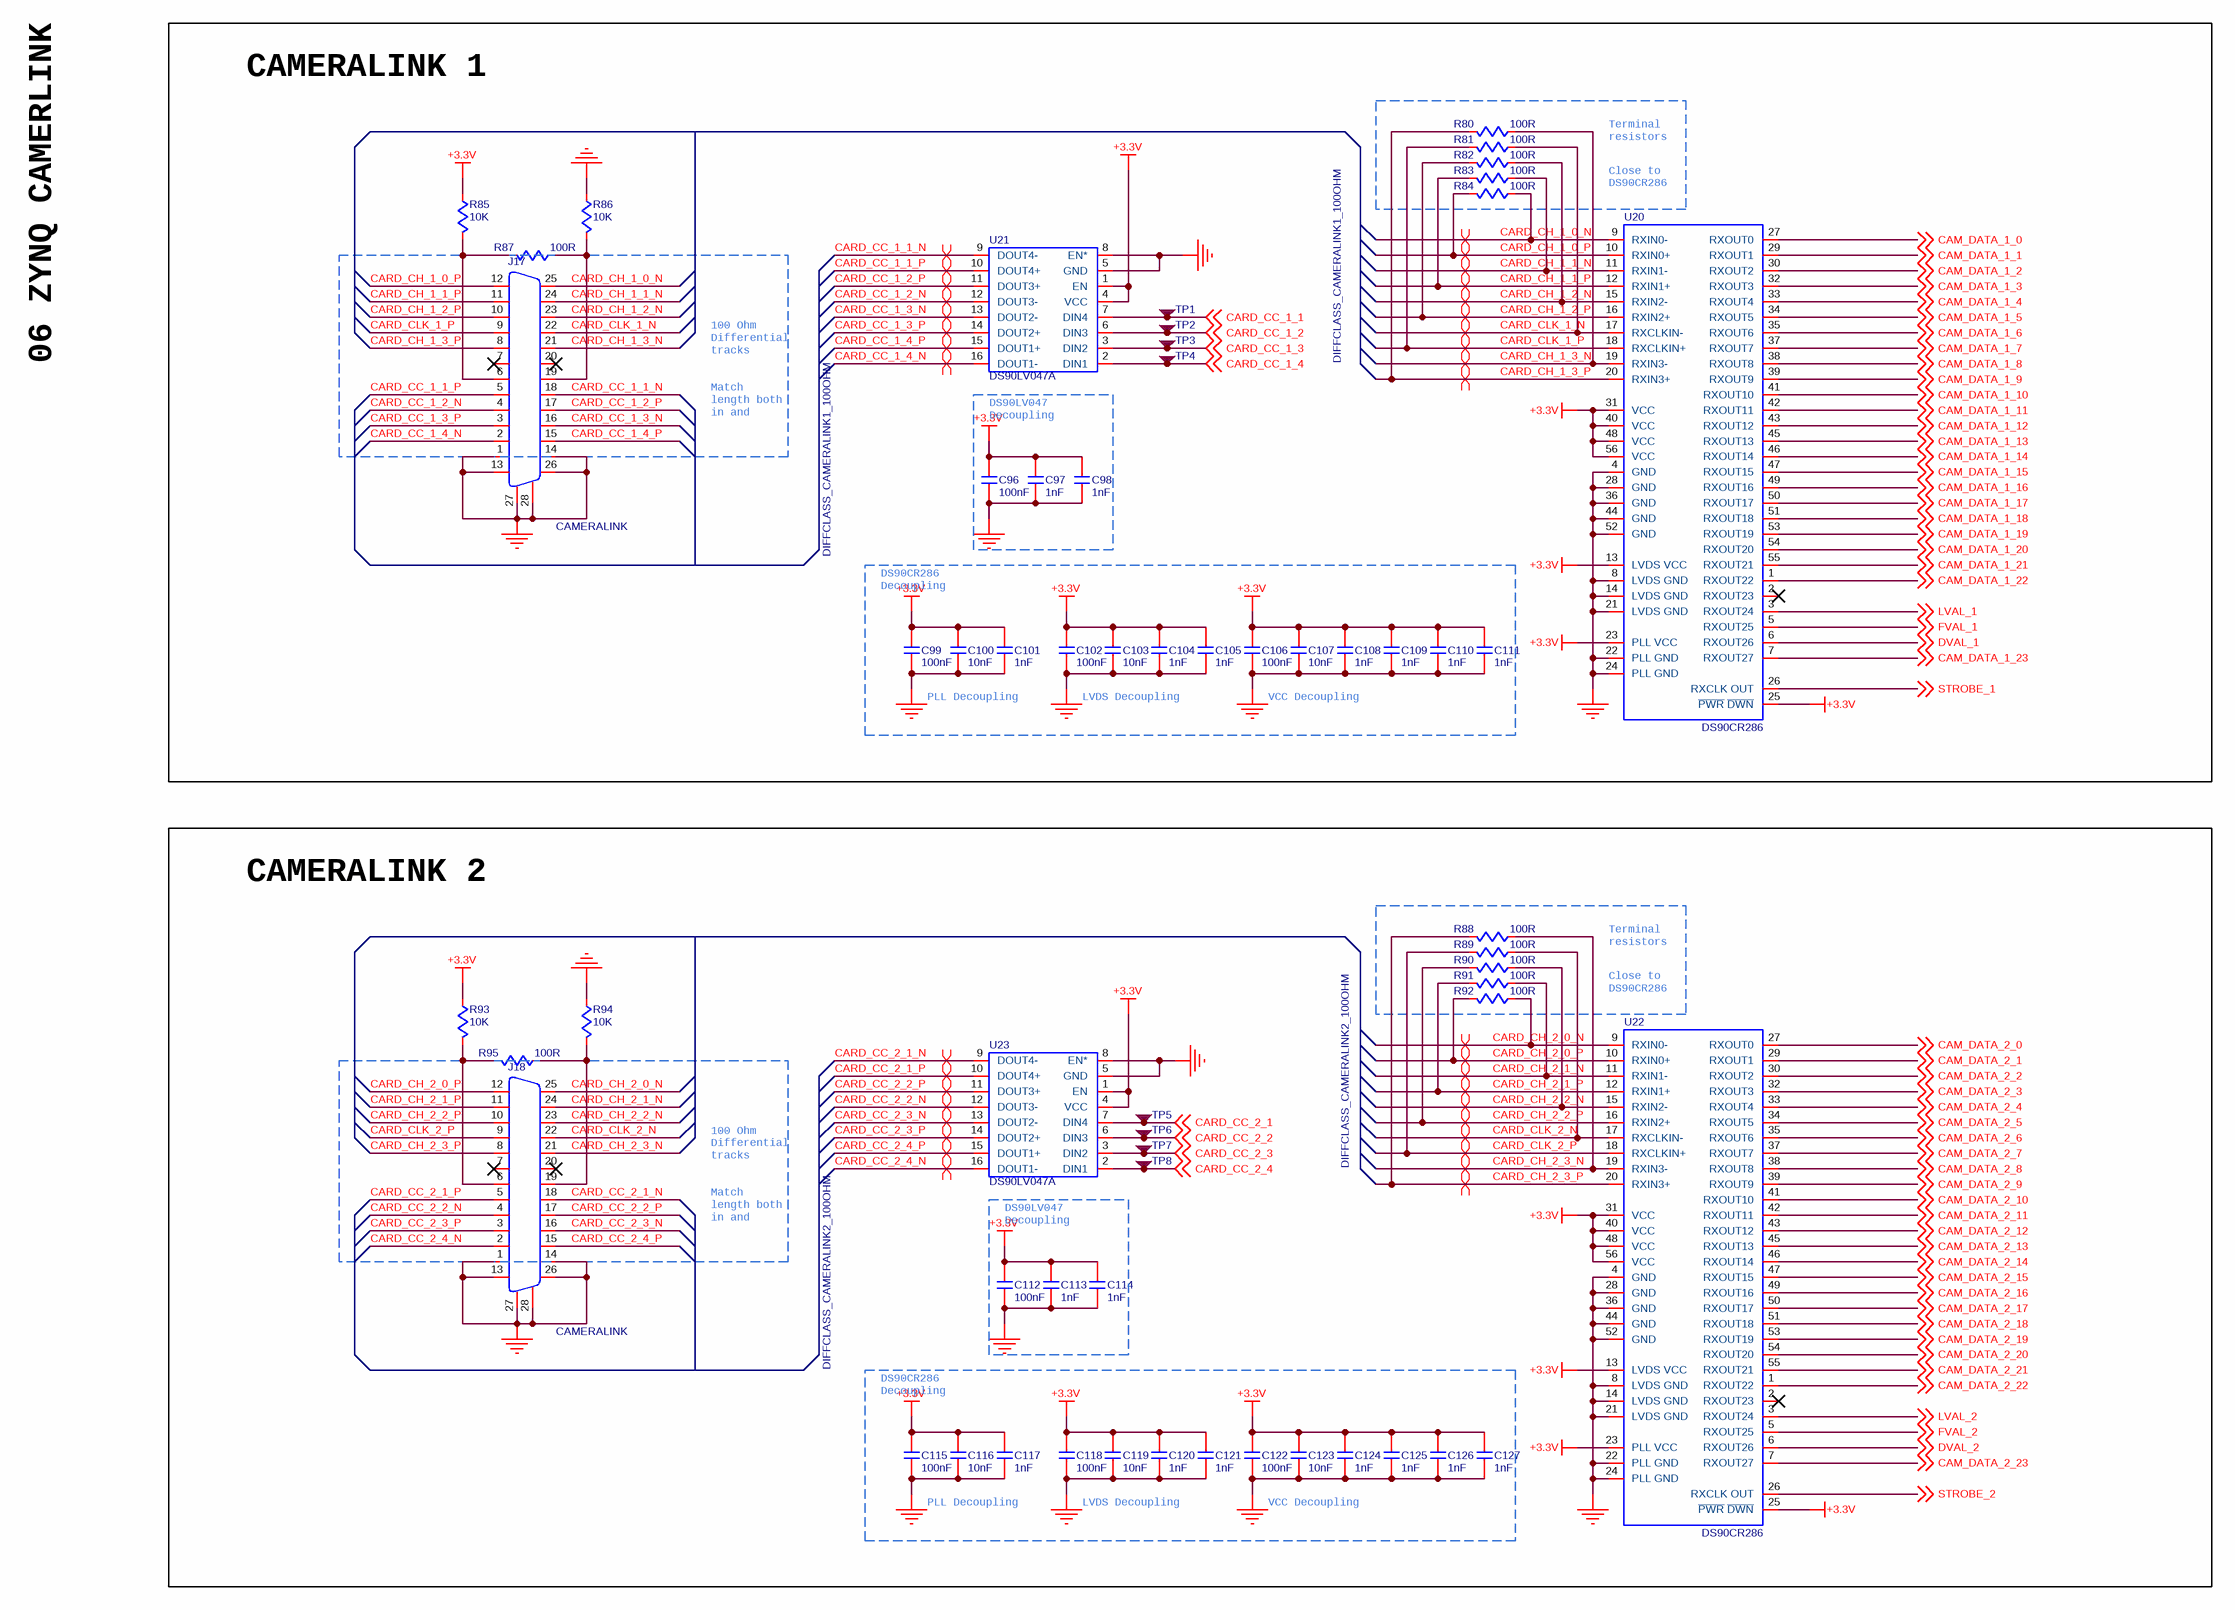
[diagram p9: 06_ZYNQ_CAMERALINK.SchDoc]

### Parts
C96  value 100nF  [C0402]  (hidden comment: C-NOMO)
C97  value 1nF  [C0402]  (hidden comment: C-NOMO)
C98  value 1nF  [C0402]  (hidden comment: C-NOMO)
C99  value 100nF  [C0402]  (hidden comment: C-NOMO)
C100  value 10nF  [C0402]  (hidden comment: C-NOMO)
C101  value 1nF  [C0402]  (hidden comment: C-NOMO)
C102  value 100nF  [C0402]  (hidden comment: C-NOMO)
C103  value 10nF  [C0402]  (hidden comment: C-NOMO)
C104  value 1nF  [C0402]  (hidden comment: C-NOMO)
C105  value 1nF  [C0402]  (hidden comment: C-NOMO)
C106  value 100nF  [C0402]  (hidden comment: C-NOMO)
C107  value 10nF  [C0402]  (hidden comment: C-NOMO)
C108  value 1nF  [C0402]  (hidden comment: C-NOMO)
C109  value 1nF  [C0402]  (hidden comment: C-NOMO)
C110  value 1nF  [C0402]  (hidden comment: C-NOMO)
C111  value 1nF  [C0402]  (hidden comment: C-NOMO)
C112  value 100nF  [C0402]  (hidden comment: C-NOMO)
C113  value 1nF  [C0402]  (hidden comment: C-NOMO)
C114  value 1nF  [C0402]  (hidden comment: C-NOMO)
C115  value 100nF  [C0402]  (hidden comment: C-NOMO)
C116  value 10nF  [C0402]  (hidden comment: C-NOMO)
C117  value 1nF  [C0402]  (hidden comment: C-NOMO)
C118  value 100nF  [C0402]  (hidden comment: C-NOMO)
C119  value 10nF  [C0402]  (hidden comment: C-NOMO)
C120  value 1nF  [C0402]  (hidden comment: C-NOMO)
C121  value 1nF  [C0402]  (hidden comment: C-NOMO)
C122  value 100nF  [C0402]  (hidden comment: C-NOMO)
C123  value 10nF  [C0402]  (hidden comment: C-NOMO)
C124  value 1nF  [C0402]  (hidden comment: C-NOMO)
C125  value 1nF  [C0402]  (hidden comment: C-NOMO)
C126  value 1nF  [C0402]  (hidden comment: C-NOMO)
C127  value 1nF  [C0402]  (hidden comment: C-NOMO)
J17  CAMERALINK  [CAMERALINK]
J18  CAMERALINK  [CAMERALINK]
R80  value 100R  [R0402]  (hidden comment: R)
R81  value 100R  [R0402]  (hidden comment: R)
R82  value 100R  [R0402]  (hidden comment: R)
R83  value 100R  [R0402]  (hidden comment: R)
R84  value 100R  [R0402]  (hidden comment: R)
R85  value 10K  [R0402]  (hidden comment: R)
R86  value 10K  [R0402]  (hidden comment: R)
R87  value 100R  [R0402]  (hidden comment: R)
R88  value 100R  [R0402]  (hidden comment: R)
R89  value 100R  [R0402]  (hidden comment: R)
R90  value 100R  [R0402]  (hidden comment: R)
R91  value 100R  [R0402]  (hidden comment: R)
R92  value 100R  [R0402]  (hidden comment: R)
R93  value 10K  [R0402]  (hidden comment: R)
R94  value 10K  [R0402]  (hidden comment: R)
R95  value 100R  [R0402]  (hidden comment: R)
TP1  TP  [TP]  (value not drawn)
TP2  TP  [TP]  (value not drawn)
TP3  TP  [TP]  (value not drawn)
TP4  TP  [TP]  (value not drawn)
TP5  TP  [TP]  (value not drawn)
TP6  TP  [TP]  (value not drawn)
TP7  TP  [TP]  (value not drawn)
TP8  TP  [TP]  (value not drawn)
U20  DS90CR286  [DS90CR286]
U21  DS90LV047A  [DS90LV047]
U22  DS90CR286  [DS90CR286]
U23  DS90LV047A  [DS90LV047]

### Blocks framed on the sheet
CAMERALINK 1: C96-C111 J17 R80-R87 TP1-TP4 U20 U21
CAMERALINK 2: C112-C127 J18 R88-R95 TP5-TP8 U22 U23

### Nets
+3.3V: C96.2 C97.2 C98.2 C99.2 C100.2 C101.2 C102.2 C103.2 C104.2 C105.2 C106.2 C107.2 C108.2 C109.2 C110.2 C111.2 C112.2 C113.2 C114.2 C115.2 C116.2 C117.2 C118.2 C119.2 C120.2 C121.2 C122.2 C123.2 C124.2 C125.2 C126.2 C127.2 R85.2 R93.2 U20.13(LVDS_VCC) U20.23(PLL_VCC) U20.25(~{PWR}_~{DWN}) U20.31(VCC) U20.40(VCC) U20.48(VCC) U20.56(VCC) U21.1(EN) U21.4(VCC) U22.13(LVDS_VCC) U22.23(PLL_VCC) U22.25(~{PWR}_~{DWN}) U22.31(VCC) U22.40(VCC) U22.48(VCC) U22.56(VCC) U23.1(EN) U23.4(VCC)
GND: C96.1 C97.1 C98.1 C99.1 C100.1 C101.1 C102.1 C103.1 C104.1 C105.1 C106.1 C107.1 C108.1 C109.1 C110.1 C111.1 C112.1 C113.1 C114.1 C115.1 C116.1 C117.1 C118.1 C119.1 C120.1 C121.1 C122.1 C123.1 C124.1 C125.1 C126.1 C127.1 J17.1 J17.13 J17.14 J17.26 J17.27 J17.28 J18.1 J18.13 J18.14 J18.26 J18.27 J18.28 R86.2 R94.2 U20.4(GND) U20.8(LVDS_GND) U20.14(LVDS_GND) U20.21(LVDS_GND) U20.22(PLL_GND) U20.24(PLL_GND) U20.28(GND) U20.36(GND) U20.44(GND) U20.52(GND) U21.5(GND) U21.8(EN*) U22.4(GND) U22.8(LVDS_GND) U22.14(LVDS_GND) U22.21(LVDS_GND) U22.22(PLL_GND) U22.24(PLL_GND) U22.28(GND) U22.36(GND) U22.44(GND) U22.52(GND) U23.5(GND) U23.8(EN*)
CAM_DATA_1_0: U20.27(RXOUT0) ; off-sheet CAM_DATA_1_0
CAM_DATA_1_1: U20.29(RXOUT1) ; off-sheet CAM_DATA_1_1
CAM_DATA_1_2: U20.30(RXOUT2) ; off-sheet CAM_DATA_1_2
CAM_DATA_1_3: U20.32(RXOUT3) ; off-sheet CAM_DATA_1_3
CAM_DATA_1_4: U20.33(RXOUT4) ; off-sheet CAM_DATA_1_4
CAM_DATA_1_5: U20.34(RXOUT5) ; off-sheet CAM_DATA_1_5
CAM_DATA_1_6: U20.35(RXOUT6) ; off-sheet CAM_DATA_1_6
CAM_DATA_1_7: U20.37(RXOUT7) ; off-sheet CAM_DATA_1_7
CAM_DATA_1_8: U20.38(RXOUT8) ; off-sheet CAM_DATA_1_8
CAM_DATA_1_9: U20.39(RXOUT9) ; off-sheet CAM_DATA_1_9
CAM_DATA_1_10: U20.41(RXOUT10) ; off-sheet CAM_DATA_1_10
CAM_DATA_1_11: U20.42(RXOUT11) ; off-sheet CAM_DATA_1_11
CAM_DATA_1_12: U20.43(RXOUT12) ; off-sheet CAM_DATA_1_12
CAM_DATA_1_13: U20.45(RXOUT13) ; off-sheet CAM_DATA_1_13
CAM_DATA_1_14: U20.46(RXOUT14) ; off-sheet CAM_DATA_1_14
CAM_DATA_1_15: U20.47(RXOUT15) ; off-sheet CAM_DATA_1_15
CAM_DATA_1_16: U20.49(RXOUT16) ; off-sheet CAM_DATA_1_16
CAM_DATA_1_17: U20.50(RXOUT17) ; off-sheet CAM_DATA_1_17
CAM_DATA_1_18: U20.51(RXOUT18) ; off-sheet CAM_DATA_1_18
CAM_DATA_1_19: U20.53(RXOUT19) ; off-sheet CAM_DATA_1_19
CAM_DATA_1_20: U20.54(RXOUT20) ; off-sheet CAM_DATA_1_20
CAM_DATA_1_21: U20.55(RXOUT21) ; off-sheet CAM_DATA_1_21
CAM_DATA_1_22: U20.1(RXOUT22) ; off-sheet CAM_DATA_1_22
CAM_DATA_1_23: U20.7(RXOUT27) ; off-sheet CAM_DATA_1_23
CAM_DATA_2_0: U22.27(RXOUT0) ; off-sheet CAM_DATA_2_0
CAM_DATA_2_1: U22.29(RXOUT1) ; off-sheet CAM_DATA_2_1
CAM_DATA_2_2: U22.30(RXOUT2) ; off-sheet CAM_DATA_2_2
CAM_DATA_2_3: U22.32(RXOUT3) ; off-sheet CAM_DATA_2_3
CAM_DATA_2_4: U22.33(RXOUT4) ; off-sheet CAM_DATA_2_4
CAM_DATA_2_5: U22.34(RXOUT5) ; off-sheet CAM_DATA_2_5
CAM_DATA_2_6: U22.35(RXOUT6) ; off-sheet CAM_DATA_2_6
CAM_DATA_2_7: U22.37(RXOUT7) ; off-sheet CAM_DATA_2_7
CAM_DATA_2_8: U22.38(RXOUT8) ; off-sheet CAM_DATA_2_8
CAM_DATA_2_9: U22.39(RXOUT9) ; off-sheet CAM_DATA_2_9
CAM_DATA_2_10: U22.41(RXOUT10) ; off-sheet CAM_DATA_2_10
CAM_DATA_2_11: U22.42(RXOUT11) ; off-sheet CAM_DATA_2_11
CAM_DATA_2_12: U22.43(RXOUT12) ; off-sheet CAM_DATA_2_12
CAM_DATA_2_13: U22.45(RXOUT13) ; off-sheet CAM_DATA_2_13
CAM_DATA_2_14: U22.46(RXOUT14) ; off-sheet CAM_DATA_2_14
CAM_DATA_2_15: U22.47(RXOUT15) ; off-sheet CAM_DATA_2_15
CAM_DATA_2_16: U22.49(RXOUT16) ; off-sheet CAM_DATA_2_16
CAM_DATA_2_17: U22.50(RXOUT17) ; off-sheet CAM_DATA_2_17
CAM_DATA_2_18: U22.51(RXOUT18) ; off-sheet CAM_DATA_2_18
CAM_DATA_2_19: U22.53(RXOUT19) ; off-sheet CAM_DATA_2_19
CAM_DATA_2_20: U22.54(RXOUT20) ; off-sheet CAM_DATA_2_20
CAM_DATA_2_21: U22.55(RXOUT21) ; off-sheet CAM_DATA_2_21
CAM_DATA_2_22: U22.1(RXOUT22) ; off-sheet CAM_DATA_2_22
CAM_DATA_2_23: U22.7(RXOUT27) ; off-sheet CAM_DATA_2_23
CARD_CC_1_1: TP1.0 U21.7(DIN4) ; off-sheet CARD_CC_1_1
CARD_CC_1_1_N: J17.18 U21.9(DOUT4-)
CARD_CC_1_1_P: J17.5 U21.10(DOUT4+)
CARD_CC_1_2: TP2.0 U21.6(DIN3) ; off-sheet CARD_CC_1_2
CARD_CC_1_2_N: J17.4 U21.12(DOUT3-)
CARD_CC_1_2_P: J17.17 U21.11(DOUT3+)
CARD_CC_1_3: TP3.0 U21.3(DIN2) ; off-sheet CARD_CC_1_3
CARD_CC_1_3_N: J17.16 U21.13(DOUT2-)
CARD_CC_1_3_P: J17.3 U21.14(DOUT2+)
CARD_CC_1_4: TP4.0 U21.2(DIN1) ; off-sheet CARD_CC_1_4
CARD_CC_1_4_N: J17.2 U21.16(DOUT1-)
CARD_CC_1_4_P: J17.15 U21.15(DOUT1+)
CARD_CC_2_1: TP5.0 U23.7(DIN4) ; off-sheet CARD_CC_2_1
CARD_CC_2_1_N: J18.18 U23.9(DOUT4-)
CARD_CC_2_1_P: J18.5 U23.10(DOUT4+)
CARD_CC_2_2: TP6.0 U23.6(DIN3) ; off-sheet CARD_CC_2_2
CARD_CC_2_2_N: J18.4 U23.12(DOUT3-)
CARD_CC_2_2_P: J18.17 U23.11(DOUT3+)
CARD_CC_2_3: TP7.0 U23.3(DIN2) ; off-sheet CARD_CC_2_3
CARD_CC_2_3_N: J18.16 U23.13(DOUT2-)
CARD_CC_2_3_P: J18.3 U23.14(DOUT2+)
CARD_CC_2_4: TP8.0 U23.2(DIN1) ; off-sheet CARD_CC_2_4
CARD_CC_2_4_N: J18.2 U23.16(DOUT1-)
CARD_CC_2_4_P: J18.15 U23.15(DOUT1+)
CARD_CH_1_0_N: J17.25 R84.2 U20.9(RXIN0-)
CARD_CH_1_0_P: J17.12 R84.1 U20.10(RXIN0+)
CARD_CH_1_1_N: J17.24 R83.2 U20.11(RXIN1-)
CARD_CH_1_1_P: J17.11 R83.1 U20.12(RXIN1+)
CARD_CH_1_2_N: J17.23 R82.2 U20.15(RXIN2-)
CARD_CH_1_2_P: J17.10 R82.1 U20.16(RXIN2+)
CARD_CH_1_3_N: J17.21 R80.2 U20.19(RXIN3-)
CARD_CH_1_3_P: J17.8 R80.1 U20.20(RXIN3+)
CARD_CH_2_0_N: J18.25 R92.2 U22.9(RXIN0-)
CARD_CH_2_0_P: J18.12 R92.1 U22.10(RXIN0+)
CARD_CH_2_1_N: J18.24 R91.2 U22.11(RXIN1-)
CARD_CH_2_1_P: J18.11 R91.1 U22.12(RXIN1+)
CARD_CH_2_2_N: J18.23 R90.2 U22.15(RXIN2-)
CARD_CH_2_2_P: J18.10 R90.1 U22.16(RXIN2+)
CARD_CH_2_3_N: J18.21 R88.2 U22.19(RXIN3-)
CARD_CH_2_3_P: J18.8 R88.1 U22.20(RXIN3+)
CARD_CLK_1_N: J17.22 R81.2 U20.17(RXCLKIN-)
CARD_CLK_1_P: J17.9 R81.1 U20.18(RXCLKIN+)
CARD_CLK_2_N: J18.22 R89.2 U22.17(RXCLKIN-)
CARD_CLK_2_P: J18.9 R89.1 U22.18(RXCLKIN+)
DVAL_1: U20.6(RXOUT26) ; off-sheet DVAL_1
DVAL_2: U22.6(RXOUT26) ; off-sheet DVAL_2
FVAL_1: U20.5(RXOUT25) ; off-sheet FVAL_1
FVAL_2: U22.5(RXOUT25) ; off-sheet FVAL_2
LVAL_1: U20.3(RXOUT24) ; off-sheet LVAL_1
LVAL_2: U22.3(RXOUT24) ; off-sheet LVAL_2
STROBE_1: U20.26(RXCLK_OUT) ; off-sheet STROBE_1
STROBE_2: U22.26(RXCLK_OUT) ; off-sheet STROBE_2
NetJ17_6: J17.6 R85.1 R87.1
NetJ17_19: J17.19 R86.1 R87.2
NetJ18_6: J18.6 R93.1 R95.1
NetJ18_19: J18.19 R94.1 R95.2

Not connected (* = marked no-connect by the designer): J17 7* 20*; J18 7* 20*; U20 2(RXOUT23)*; U22 2(RXOUT23)*

### Layout directives
differential pair; differential pair class DIFFCLASS_CAMERALINK1_100OHM: CARD_CC_1_1_N, CARD_CC_1_1_P, CARD_CC_1_2_N, CARD_CC_1_2_P, CARD_CC_1_3_N, CARD_CC_1_3_P, CARD_CC_1_4_N, CARD_CC_1_4_P, CARD_CH_1_0_N, CARD_CH_1_0_P, CARD_CH_1_1_N, CARD_CH_1_1_P, CARD_CH_1_2_N, CARD_CH_1_2_P, CARD_CH_1_3_N, CARD_CH_1_3_P, CARD_CLK_1_N, CARD_CLK_1_P
differential pair; differential pair class DIFFCLASS_CAMERALINK2_100OHM: CARD_CC_2_1_N, CARD_CC_2_1_P, CARD_CC_2_2_N, CARD_CC_2_2_P, CARD_CC_2_3_N, CARD_CC_2_3_P, CARD_CC_2_4_N, CARD_CC_2_4_P, CARD_CH_2_0_N, CARD_CH_2_0_P, CARD_CH_2_1_N, CARD_CH_2_1_P, CARD_CH_2_2_N, CARD_CH_2_2_P, CARD_CH_2_3_N, CARD_CH_2_3_P, CARD_CLK_2_N, CARD_CLK_2_P

### Notes on the sheet
- Terminal resistors
- (near U20) Close to DS90CR286
- 06 ZYNQ CAMERLINK
- 100 Ohm Differential tracks
  Match length both in and between pairs
- DS90LV047 Decoupling
- DS90CR286 Decoupling
- PLL Decoupling
- LVDS Decoupling
- VCC Decoupling
- (near U22) Close to DS90CR286

### Library data of the parts
C96-C127 = C-NOMO: voltage: 25V; precision: 5%
R80-R95 = R: precision: 1%